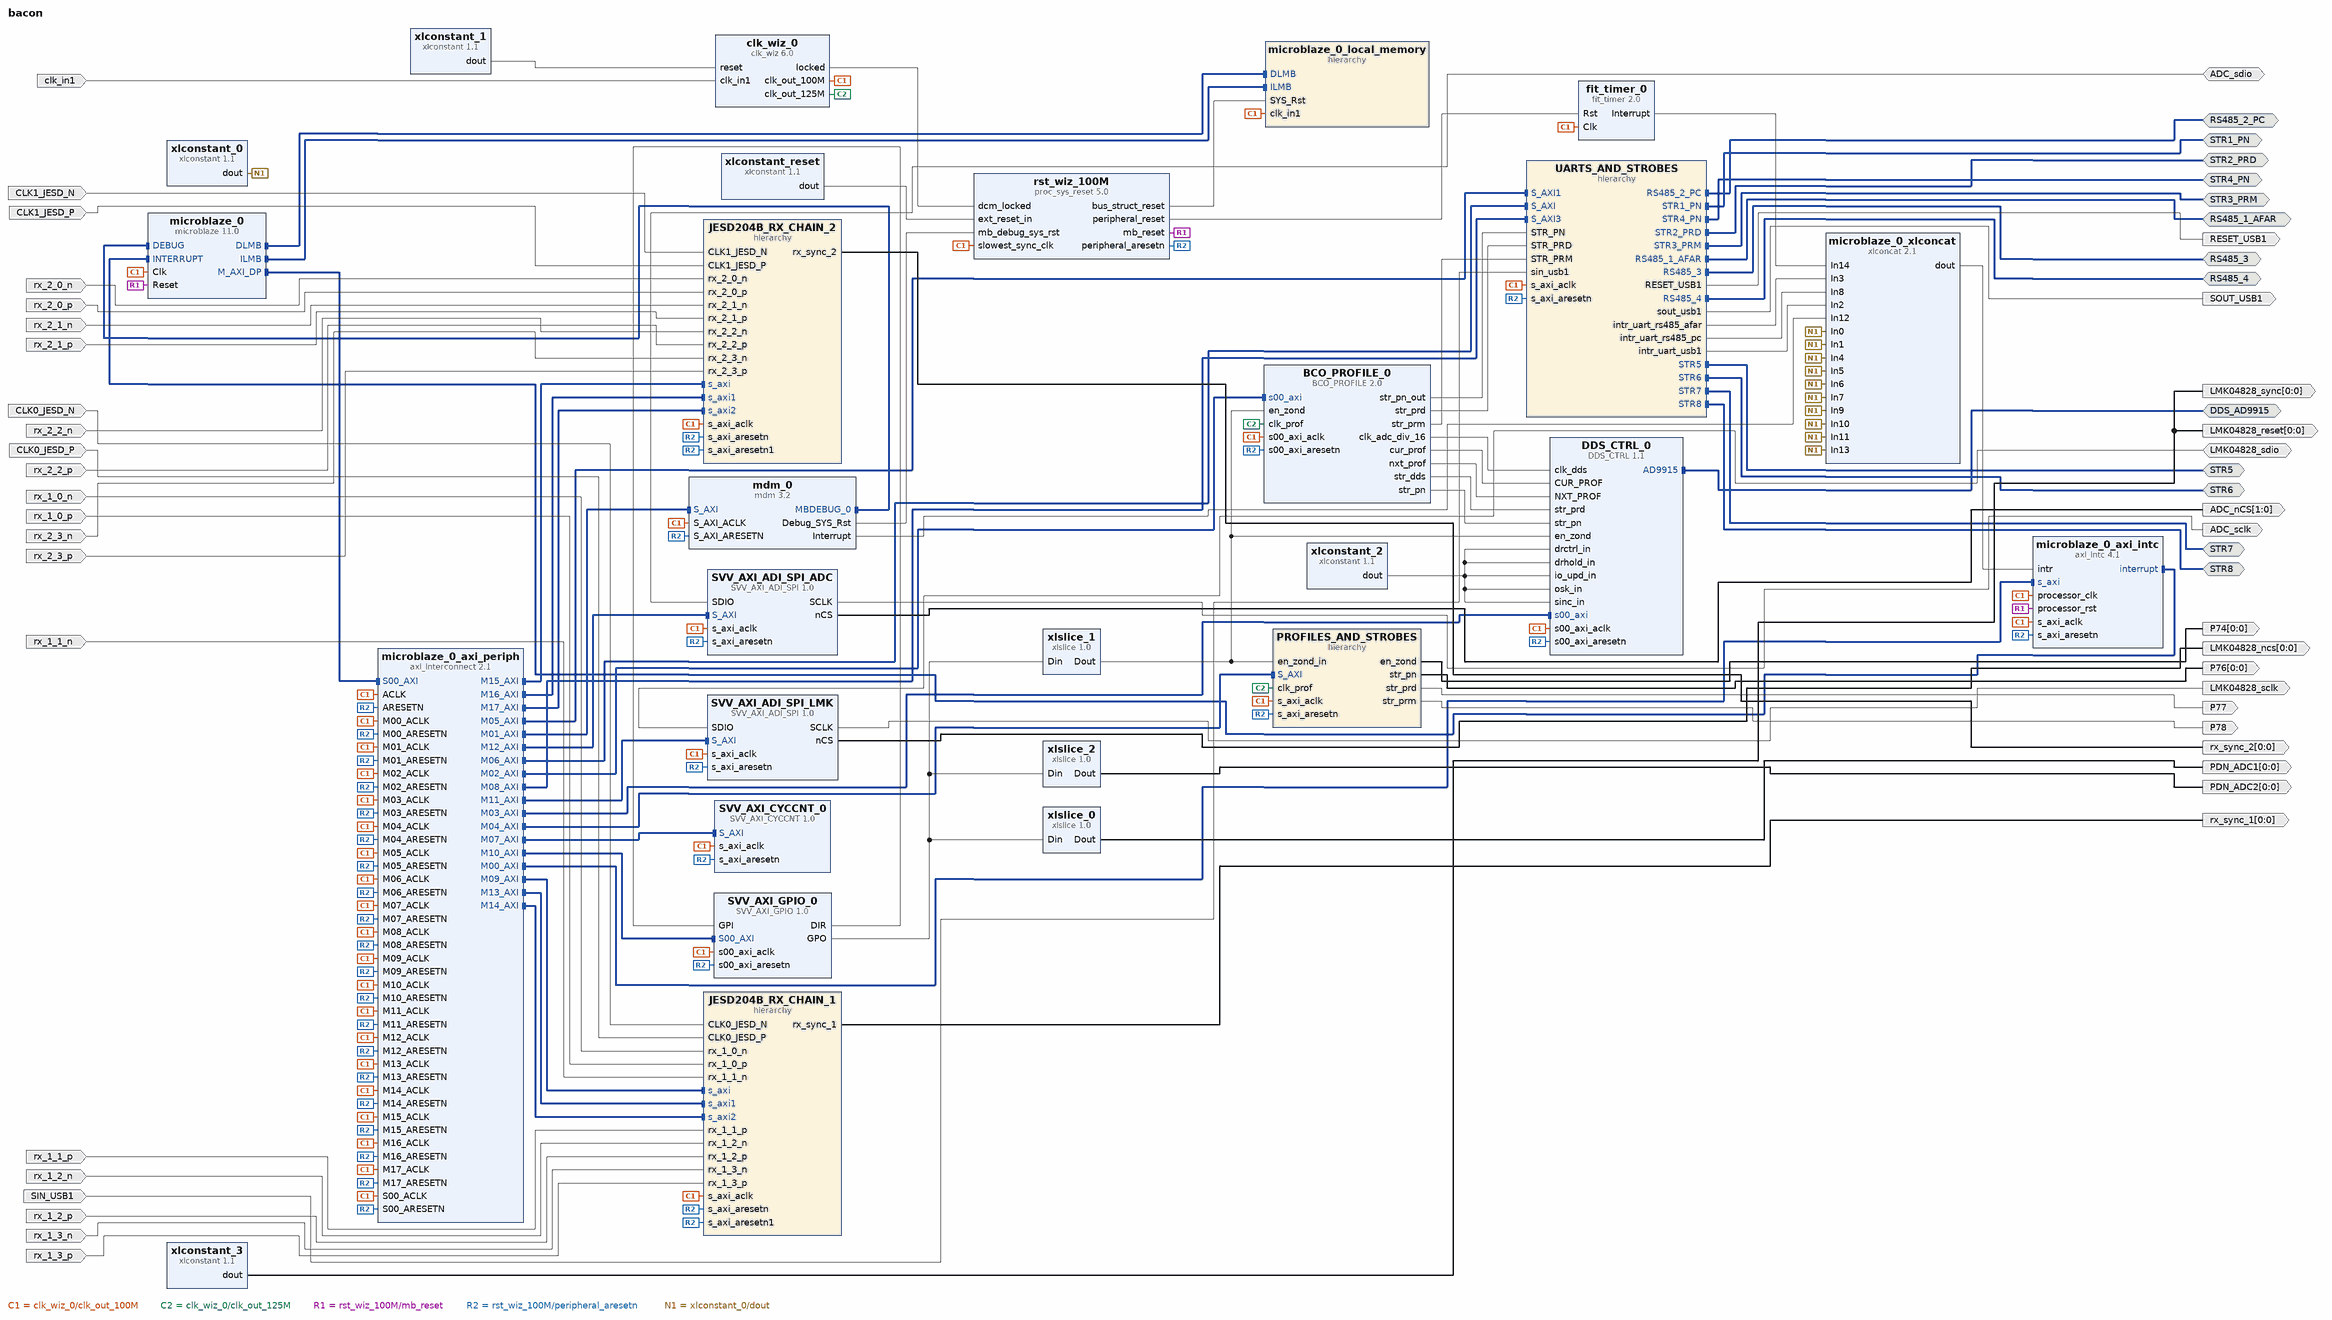
[diagram p0: block diagram of the top level]
# Vivado block design bacon, xc7k410tffg900-2, Vivado 2023.2.2
create_bd_design bacon

create_bd_intf_port -mode Master -vlnv eliars:user:DDS_AD9915_CTRL_rtl:1.0 DDS_AD9915
create_bd_intf_port -mode Master -vlnv eliars:user:SER_TRANS_rtl:1.0 STR4_PN
create_bd_intf_port -mode Master -vlnv eliars:user:SER_TRANS_rtl:1.0 STR1_PN
create_bd_intf_port -mode Master -vlnv eliars:user:SER_TRANS_rtl:1.0 STR2_PRD
create_bd_intf_port -mode Master -vlnv eliars:user:SER_TRANS_rtl:1.0 STR3_PRM
create_bd_intf_port -mode Master -vlnv eliars:user:SER_TRANS_rtl:1.0 RS485_2_PC
create_bd_intf_port -mode Master -vlnv eliars:user:SER_TRANS_rtl:1.0 RS485_1_AFAR
create_bd_intf_port -mode Master -vlnv eliars:user:SER_TRANS_rtl:1.0 RS485_3
create_bd_intf_port -mode Master -vlnv eliars:user:SER_TRANS_rtl:1.0 RS485_4
create_bd_intf_port -mode Master -vlnv eliars:user:SER_TRANS_rtl:1.0 STR5
create_bd_intf_port -mode Master -vlnv eliars:user:SER_TRANS_rtl:1.0 STR6
create_bd_intf_port -mode Master -vlnv eliars:user:SER_TRANS_rtl:1.0 STR7
create_bd_intf_port -mode Master -vlnv eliars:user:SER_TRANS_rtl:1.0 STR8
create_bd_port -dir I -type clk clk_in1
set_property -dict {CONFIG.FREQ_HZ 100000000} [get_bd_ports clk_in1]
create_bd_port -dir O SOUT_USB1
create_bd_port -dir I SIN_USB1
create_bd_port -dir I CLK0_JESD_P
create_bd_port -dir I CLK0_JESD_N
create_bd_port -dir I CLK1_JESD_P
create_bd_port -dir I CLK1_JESD_N
create_bd_port -dir O RESET_USB1
create_bd_port -dir O -from 0 -to 0 P76
create_bd_port -dir O P77
create_bd_port -dir O -from 0 -to 0 P74
create_bd_port -dir O P78
create_bd_port -dir I rx_1_0_p
create_bd_port -dir I rx_1_0_n
create_bd_port -dir I rx_1_1_p
create_bd_port -dir I rx_1_1_n
create_bd_port -dir I rx_1_2_p
create_bd_port -dir I rx_1_2_n
create_bd_port -dir I rx_1_3_p
create_bd_port -dir I rx_1_3_n
create_bd_port -dir O -from 0 -to 0 rx_sync_1
create_bd_port -dir IO LMK04828_sdio
create_bd_port -dir O LMK04828_sclk
create_bd_port -dir O -from 0 -to 0 LMK04828_ncs
create_bd_port -dir O -from 0 -to 0 LMK04828_reset
create_bd_port -dir O -from 0 -to 0 LMK04828_sync
create_bd_port -dir O -from 0 -to 0 PDN_ADC1
create_bd_port -dir O -from 0 -to 0 PDN_ADC2
create_bd_port -dir O -from 1 -to 0 ADC_nCS
create_bd_port -dir IO ADC_sdio
create_bd_port -dir O ADC_sclk
create_bd_port -dir I rx_2_0_p
create_bd_port -dir I rx_2_0_n
create_bd_port -dir I rx_2_1_p
create_bd_port -dir I rx_2_1_n
create_bd_port -dir I rx_2_2_p
create_bd_port -dir I rx_2_2_n
create_bd_port -dir I rx_2_3_p
create_bd_port -dir I rx_2_3_n
create_bd_port -dir O -from 0 -to 0 rx_sync_2

create_bd_cell -type ip -vlnv xilinx.com:ip:microblaze:11.0 microblaze_0
set_property -dict [list \
  CONFIG.C_DEBUG_ENABLED 1 \
  CONFIG.C_D_AXI 1 \
  CONFIG.C_D_LMB 1 \
  CONFIG.C_I_LMB 1 \
  CONFIG.C_USE_BARREL 1 \
  CONFIG.C_USE_DIV 1 \
  CONFIG.C_USE_HW_MUL 2 \
  CONFIG.C_USE_INTERRUPT 2 \
  CONFIG.C_USE_MSR_INSTR 1 \
  CONFIG.C_USE_PCMP_INSTR 1 \
] [get_bd_cells microblaze_0]
create_bd_cell -type hier microblaze_0_local_memory
create_bd_cell -type ip -vlnv xilinx.com:ip:axi_interconnect:2.1 microblaze_0_axi_periph
set_property -dict {CONFIG.NUM_MI 18 CONFIG.NUM_SI 1} [get_bd_cells microblaze_0_axi_periph]
create_bd_cell -type ip -vlnv xilinx.com:ip:axi_intc:4.1 microblaze_0_axi_intc
set_property -dict {CONFIG.C_HAS_FAST 1 CONFIG.C_IRQ_IS_LEVEL 0} [get_bd_cells microblaze_0_axi_intc]
create_bd_cell -type ip -vlnv xilinx.com:ip:xlconcat:2.1 microblaze_0_xlconcat
set_property -dict [list \
  CONFIG.IN0_WIDTH 1 \
  CONFIG.IN10_WIDTH 1 \
  CONFIG.IN11_WIDTH 1 \
  CONFIG.IN12_WIDTH 1 \
  CONFIG.IN13_WIDTH 1 \
  CONFIG.IN14_WIDTH 1 \
  CONFIG.IN1_WIDTH 1 \
  CONFIG.IN2_WIDTH 1 \
  CONFIG.IN3_WIDTH 1 \
  CONFIG.IN4_WIDTH 1 \
  CONFIG.IN5_WIDTH 1 \
  CONFIG.IN6_WIDTH 1 \
  CONFIG.IN7_WIDTH 1 \
  CONFIG.IN8_WIDTH 1 \
  CONFIG.IN9_WIDTH 1 \
  CONFIG.NUM_PORTS 15 \
] [get_bd_cells microblaze_0_xlconcat]
create_bd_cell -type ip -vlnv xilinx.com:ip:mdm:3.2 mdm_0
set_property -dict {CONFIG.C_ADDR_SIZE 32 CONFIG.C_M_AXI_ADDR_WIDTH 32 CONFIG.C_USE_UART 1} [get_bd_cells mdm_0]
create_bd_cell -type ip -vlnv xilinx.com:ip:proc_sys_reset:5.0 rst_wiz_100M
create_bd_cell -type ip -vlnv xilinx.com:ip:clk_wiz:6.0 clk_wiz_0
set_property -dict [list \
  CONFIG.CLKIN2_JITTER_PS 166.66 \
  CONFIG.CLKOUT2_JITTER 125.247 \
  CONFIG.CLKOUT2_PHASE_ERROR 98.575 \
  CONFIG.CLKOUT2_REQUESTED_OUT_FREQ 125.000 \
  CONFIG.CLKOUT2_USED true \
  CONFIG.CLKOUT3_JITTER 114.829 \
  CONFIG.CLKOUT3_PHASE_ERROR 98.575 \
  CONFIG.CLKOUT3_REQUESTED_OUT_FREQ 200.000 \
  CONFIG.CLKOUT3_USED true \
  CONFIG.CLKOUT4_JITTER 159.371 \
  CONFIG.CLKOUT4_PHASE_ERROR 98.575 \
  CONFIG.CLKOUT4_REQUESTED_OUT_FREQ 40.000 \
  CONFIG.CLKOUT4_USED true \
  CONFIG.CLK_OUT1_PORT clk_out_100M \
  CONFIG.CLK_OUT2_PORT clk_out_125M \
  CONFIG.CLK_OUT3_PORT clk_out_200M \
  CONFIG.CLK_OUT4_PORT clk_out_40M \
  CONFIG.MMCM_CLKIN2_PERIOD 10.000 \
  CONFIG.MMCM_CLKOUT1_DIVIDE 8 \
  CONFIG.MMCM_CLKOUT2_DIVIDE 5 \
  CONFIG.MMCM_CLKOUT3_DIVIDE 25 \
  CONFIG.NUM_OUT_CLKS 4 \
  CONFIG.SECONDARY_IN_FREQ 100.000 \
  CONFIG.SECONDARY_SOURCE Single_ended_clock_capable_pin \
  CONFIG.USE_INCLK_SWITCHOVER false \
] [get_bd_cells clk_wiz_0]
create_bd_cell -type ip -vlnv xilinx.com:ip:xlconstant:1.1 xlconstant_reset
create_bd_cell -type ip -vlnv xilinx.com:ip:xlconstant:1.1 xlconstant_0
set_property -dict {CONFIG.CONST_VAL 0 CONFIG.CONST_WIDTH 1} [get_bd_cells xlconstant_0]
create_bd_cell -type ip -vlnv eliars.ru:user:BCO_PROFILE:2.0 BCO_PROFILE_0
create_bd_cell -type ip -vlnv eliars.ru:user:DDS_CTRL:1.1 DDS_CTRL_0
create_bd_cell -type ip -vlnv xilinx.com:ip:xlconstant:1.1 xlconstant_2
set_property -dict {CONFIG.CONST_VAL 0} [get_bd_cells xlconstant_2]
create_bd_cell -type hier UARTS_AND_STROBES
create_bd_cell -type ip -vlnv xilinx.com:user:SVV_AXI_CYCCNT:1.0 SVV_AXI_CYCCNT_0
create_bd_cell -type hier PROFILES_AND_STROBES
create_bd_cell -type ip -vlnv xilinx.com:ip:xlconstant:1.1 xlconstant_1
set_property -dict {CONFIG.CONST_VAL 0} [get_bd_cells xlconstant_1]
create_bd_cell -type ip -vlnv xilinx.com:ip:fit_timer:2.0 fit_timer_0
set_property -dict {CONFIG.C_NO_CLOCKS 1000000} [get_bd_cells fit_timer_0]
create_bd_cell -type hier JESD204B_RX_CHAIN_1
create_bd_cell -type ip -vlnv xilinx.com:user:SVV_AXI_GPIO:1.0 SVV_AXI_GPIO_0
set_property -dict {CONFIG.ODR_INIT 0x00030000} [get_bd_cells SVV_AXI_GPIO_0]
create_bd_cell -type ip -vlnv xilinx.com:ip:xlslice:1.0 xlslice_1
create_bd_cell -type ip -vlnv xilinx.com:user:SVV_AXI_ADI_SPI:1.0 SVV_AXI_ADI_SPI_LMK
create_bd_cell -type ip -vlnv xilinx.com:ip:xlconstant:1.1 xlconstant_3
set_property -dict {CONFIG.CONST_VAL 0} [get_bd_cells xlconstant_3]
create_bd_cell -type ip -vlnv xilinx.com:ip:xlslice:1.0 xlslice_0
set_property -dict {CONFIG.DIN_FROM 16 CONFIG.DIN_TO 16} [get_bd_cells xlslice_0]
create_bd_cell -type ip -vlnv xilinx.com:ip:xlslice:1.0 xlslice_2
set_property -dict {CONFIG.DIN_FROM 17 CONFIG.DIN_TO 17} [get_bd_cells xlslice_2]
create_bd_cell -type ip -vlnv xilinx.com:user:SVV_AXI_ADI_SPI:1.0 SVV_AXI_ADI_SPI_ADC
set_property -dict {CONFIG.SLAVES 2} [get_bd_cells SVV_AXI_ADI_SPI_ADC]
create_bd_cell -type hier JESD204B_RX_CHAIN_2

# ---- hierarchy /microblaze_0_local_memory ----
current_bd_instance /microblaze_0_local_memory
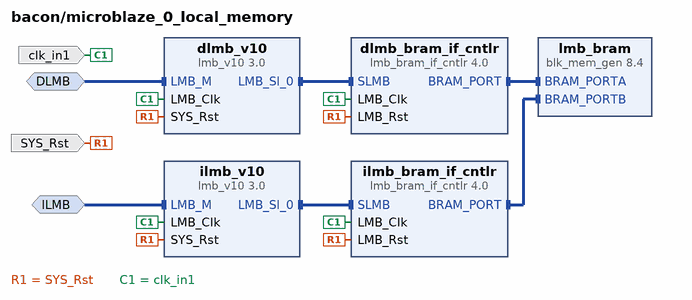
[diagram p1: block diagram inside /microblaze_0_local_memory]
create_bd_intf_pin -mode MirroredMaster -vlnv xilinx.com:interface:lmb_rtl:1.0 DLMB
create_bd_intf_pin -mode MirroredMaster -vlnv xilinx.com:interface:lmb_rtl:1.0 ILMB
create_bd_pin -dir I -type clk clk_in1
create_bd_pin -dir I -type rst SYS_Rst

create_bd_cell -type ip -vlnv xilinx.com:ip:lmb_v10:3.0 dlmb_v10
set_property -dict {CONFIG.C_LMB_NUM_SLAVES 1} [get_bd_cells dlmb_v10]
create_bd_cell -type ip -vlnv xilinx.com:ip:lmb_v10:3.0 ilmb_v10
create_bd_cell -type ip -vlnv xilinx.com:ip:lmb_bram_if_cntlr:4.0 dlmb_bram_if_cntlr
set_property -dict {CONFIG.C_ECC 0} [get_bd_cells dlmb_bram_if_cntlr]
create_bd_cell -type ip -vlnv xilinx.com:ip:lmb_bram_if_cntlr:4.0 ilmb_bram_if_cntlr
set_property -dict {CONFIG.C_ECC 0} [get_bd_cells ilmb_bram_if_cntlr]
create_bd_cell -type ip -vlnv xilinx.com:ip:blk_mem_gen:8.4 lmb_bram
set_property -dict {CONFIG.Memory_Type True_Dual_Port_RAM CONFIG.use_bram_block BRAM_Controller} [get_bd_cells lmb_bram]

# ---- hierarchy /UARTS_AND_STROBES ----
current_bd_instance /UARTS_AND_STROBES
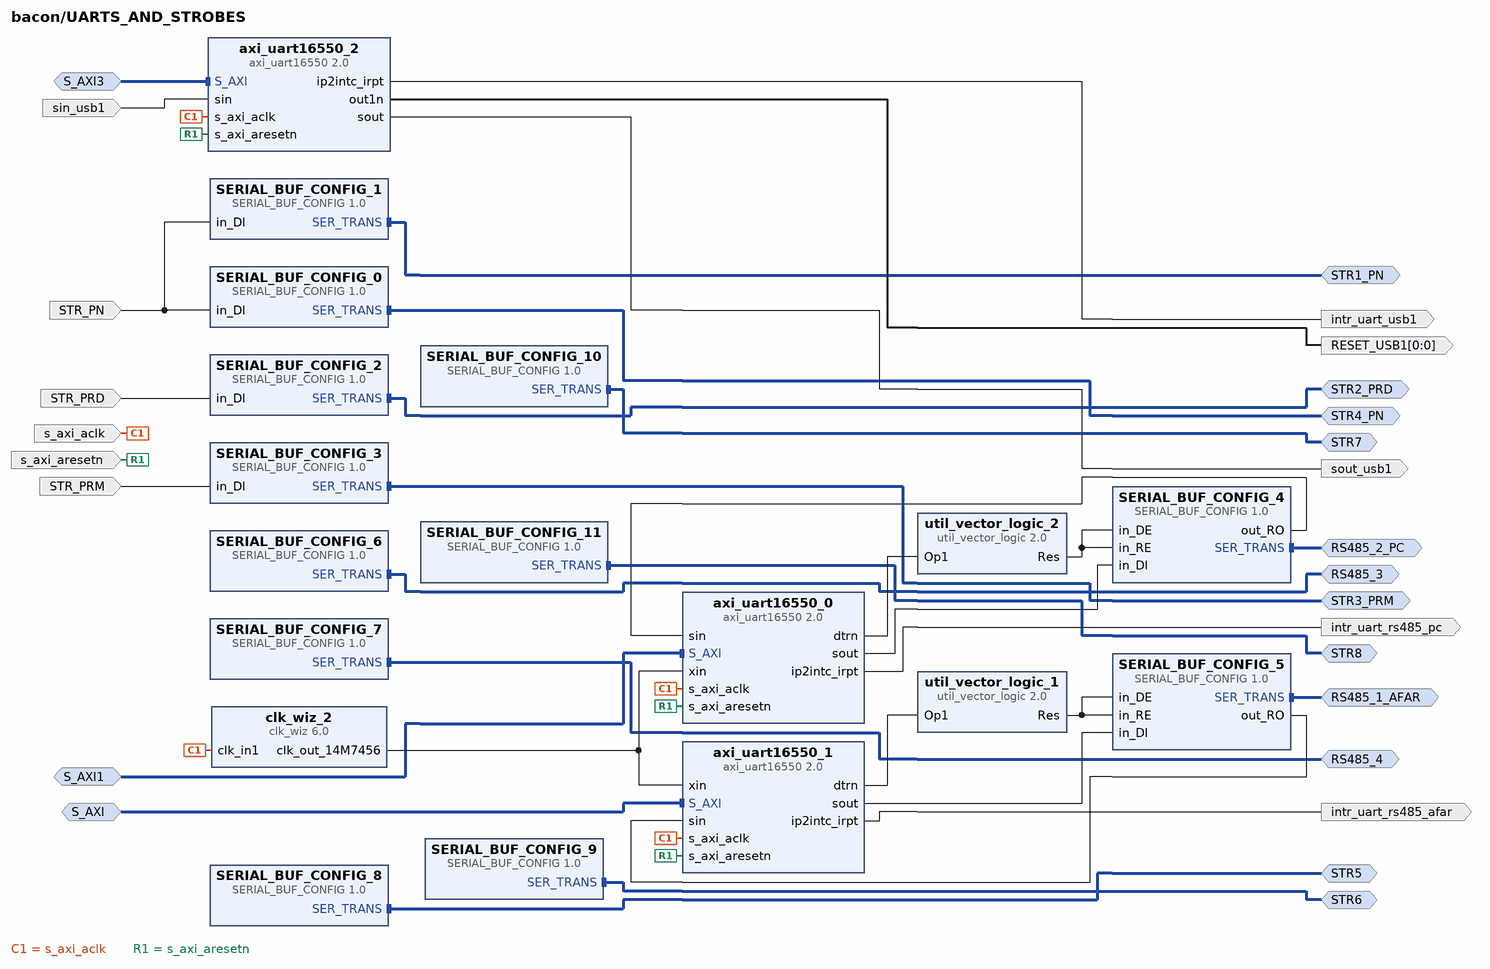
[diagram p2: block diagram inside /UARTS_AND_STROBES]
create_bd_intf_pin -mode Master -vlnv eliars:user:SER_TRANS_rtl:1.0 STR4_PN
create_bd_intf_pin -mode Slave -vlnv xilinx.com:interface:aximm_rtl:1.0 S_AXI
create_bd_intf_pin -mode Master -vlnv eliars:user:SER_TRANS_rtl:1.0 STR1_PN
create_bd_intf_pin -mode Master -vlnv eliars:user:SER_TRANS_rtl:1.0 STR2_PRD
create_bd_intf_pin -mode Master -vlnv eliars:user:SER_TRANS_rtl:1.0 STR3_PRM
create_bd_intf_pin -mode Master -vlnv eliars:user:SER_TRANS_rtl:1.0 RS485_2_PC
create_bd_intf_pin -mode Slave -vlnv xilinx.com:interface:aximm_rtl:1.0 S_AXI1
create_bd_intf_pin -mode Master -vlnv eliars:user:SER_TRANS_rtl:1.0 RS485_1_AFAR
create_bd_intf_pin -mode Master -vlnv eliars:user:SER_TRANS_rtl:1.0 RS485_3
create_bd_intf_pin -mode Slave -vlnv xilinx.com:interface:aximm_rtl:1.0 S_AXI3
create_bd_intf_pin -mode Master -vlnv eliars:user:SER_TRANS_rtl:1.0 RS485_4
create_bd_intf_pin -mode Master -vlnv eliars:user:SER_TRANS_rtl:1.0 STR5
create_bd_intf_pin -mode Master -vlnv eliars:user:SER_TRANS_rtl:1.0 STR6
create_bd_intf_pin -mode Master -vlnv eliars:user:SER_TRANS_rtl:1.0 STR7
create_bd_intf_pin -mode Master -vlnv eliars:user:SER_TRANS_rtl:1.0 STR8
create_bd_pin -dir I STR_PN
create_bd_pin -dir I -type clk s_axi_aclk
create_bd_pin -dir I -type rst s_axi_aresetn
create_bd_pin -dir I STR_PRD
create_bd_pin -dir I STR_PRM
create_bd_pin -dir O intr_uart_rs485_pc
create_bd_pin -dir O intr_uart_rs485_afar
create_bd_pin -dir O sout_usb1
create_bd_pin -dir I sin_usb1
create_bd_pin -dir O intr_uart_usb1
create_bd_pin -dir O -from 0 -to 0 RESET_USB1

create_bd_cell -type ip -vlnv eliars:user:SERIAL_BUF_CONFIG:1.0 SERIAL_BUF_CONFIG_0
set_property -dict {CONFIG.MODE {Transmit Only}} [get_bd_cells SERIAL_BUF_CONFIG_0]
create_bd_cell -type ip -vlnv xilinx.com:ip:axi_uart16550:2.0 axi_uart16550_1
set_property -dict [list \
  CONFIG.C_EXTERNAL_XIN_CLK_HZ 14745600 \
  CONFIG.C_EXTERNAL_XIN_CLK_HZ_d 14.7456 \
  CONFIG.C_HAS_EXTERNAL_XIN 1 \
] [get_bd_cells axi_uart16550_1]
create_bd_cell -type ip -vlnv eliars:user:SERIAL_BUF_CONFIG:1.0 SERIAL_BUF_CONFIG_1
set_property -dict {CONFIG.MODE {Transmit Only}} [get_bd_cells SERIAL_BUF_CONFIG_1]
create_bd_cell -type ip -vlnv eliars:user:SERIAL_BUF_CONFIG:1.0 SERIAL_BUF_CONFIG_2
set_property -dict {CONFIG.MODE {Transmit Only}} [get_bd_cells SERIAL_BUF_CONFIG_2]
create_bd_cell -type ip -vlnv eliars:user:SERIAL_BUF_CONFIG:1.0 SERIAL_BUF_CONFIG_3
set_property -dict {CONFIG.MODE {Transmit Only}} [get_bd_cells SERIAL_BUF_CONFIG_3]
create_bd_cell -type ip -vlnv eliars:user:SERIAL_BUF_CONFIG:1.0 SERIAL_BUF_CONFIG_4
create_bd_cell -type ip -vlnv xilinx.com:ip:axi_uart16550:2.0 axi_uart16550_0
set_property -dict [list \
  CONFIG.C_EXTERNAL_XIN_CLK_HZ 14745600 \
  CONFIG.C_EXTERNAL_XIN_CLK_HZ_d 14.7456 \
  CONFIG.C_HAS_EXTERNAL_XIN 1 \
] [get_bd_cells axi_uart16550_0]
create_bd_cell -type ip -vlnv eliars:user:SERIAL_BUF_CONFIG:1.0 SERIAL_BUF_CONFIG_5
set_property -dict {CONFIG.MODE {Half Duplex}} [get_bd_cells SERIAL_BUF_CONFIG_5]
create_bd_cell -type ip -vlnv xilinx.com:ip:clk_wiz:6.0 clk_wiz_2
set_property -dict [list \
  CONFIG.CLKOUT1_JITTER 462.254 \
  CONFIG.CLKOUT1_PHASE_ERROR 507.185 \
  CONFIG.CLKOUT1_REQUESTED_OUT_FREQ 14.7456 \
  CONFIG.CLK_OUT1_PORT clk_out_14M7456 \
  CONFIG.MMCM_CLKFBOUT_MULT_F 60.250 \
  CONFIG.MMCM_CLKOUT0_DIVIDE_F 58.375 \
  CONFIG.MMCM_DIVCLK_DIVIDE 7 \
  CONFIG.USE_LOCKED false \
  CONFIG.USE_RESET false \
] [get_bd_cells clk_wiz_2]
create_bd_cell -type ip -vlnv eliars:user:SERIAL_BUF_CONFIG:1.0 SERIAL_BUF_CONFIG_6
set_property -dict {CONFIG.MODE Unused} [get_bd_cells SERIAL_BUF_CONFIG_6]
create_bd_cell -type ip -vlnv xilinx.com:ip:util_vector_logic:2.0 util_vector_logic_1
set_property -dict {CONFIG.C_OPERATION not CONFIG.C_SIZE 1} [get_bd_cells util_vector_logic_1]
create_bd_cell -type ip -vlnv xilinx.com:ip:util_vector_logic:2.0 util_vector_logic_2
set_property -dict {CONFIG.C_OPERATION not} [get_bd_cells util_vector_logic_2]
create_bd_cell -type ip -vlnv eliars:user:SERIAL_BUF_CONFIG:1.0 SERIAL_BUF_CONFIG_7
set_property -dict {CONFIG.MODE Unused} [get_bd_cells SERIAL_BUF_CONFIG_7]
create_bd_cell -type ip -vlnv eliars:user:SERIAL_BUF_CONFIG:1.0 SERIAL_BUF_CONFIG_8
set_property -dict {CONFIG.MODE Unused} [get_bd_cells SERIAL_BUF_CONFIG_8]
create_bd_cell -type ip -vlnv eliars:user:SERIAL_BUF_CONFIG:1.0 SERIAL_BUF_CONFIG_9
set_property -dict {CONFIG.MODE Unused} [get_bd_cells SERIAL_BUF_CONFIG_9]
create_bd_cell -type ip -vlnv eliars:user:SERIAL_BUF_CONFIG:1.0 SERIAL_BUF_CONFIG_10
set_property -dict {CONFIG.MODE Unused} [get_bd_cells SERIAL_BUF_CONFIG_10]
create_bd_cell -type ip -vlnv eliars:user:SERIAL_BUF_CONFIG:1.0 SERIAL_BUF_CONFIG_11
set_property -dict {CONFIG.MODE Unused} [get_bd_cells SERIAL_BUF_CONFIG_11]
create_bd_cell -type ip -vlnv xilinx.com:ip:axi_uart16550:2.0 axi_uart16550_2
set_property -dict [list \
  CONFIG.C_EXTERNAL_XIN_CLK_HZ 14745600 \
  CONFIG.C_EXTERNAL_XIN_CLK_HZ_d 14.7456 \
  CONFIG.C_HAS_EXTERNAL_XIN 1 \
] [get_bd_cells axi_uart16550_2]

# ---- hierarchy /PROFILES_AND_STROBES ----
current_bd_instance /PROFILES_AND_STROBES
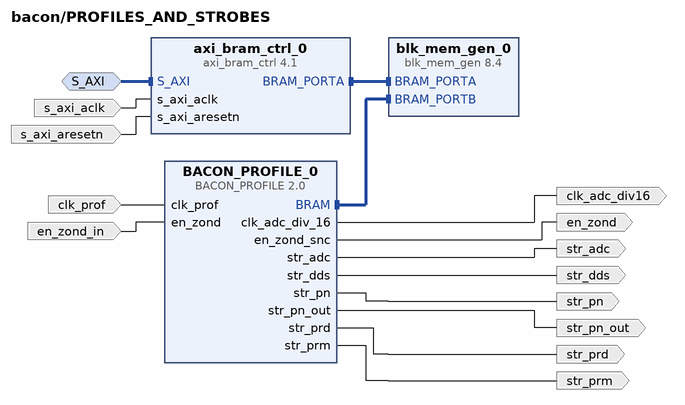
[diagram p3: block diagram inside /PROFILES_AND_STROBES]
create_bd_intf_pin -mode Slave -vlnv xilinx.com:interface:aximm_rtl:1.0 S_AXI
create_bd_pin -dir I -type clk s_axi_aclk
create_bd_pin -dir I -type rst s_axi_aresetn
create_bd_pin -dir I en_zond_in
create_bd_pin -dir I clk_prof
create_bd_pin -dir O str_pn
create_bd_pin -dir O str_pn_out
create_bd_pin -dir O str_dds
create_bd_pin -dir O str_prd
create_bd_pin -dir O str_prm
create_bd_pin -dir O str_adc
create_bd_pin -dir O clk_adc_div16
create_bd_pin -dir O en_zond

create_bd_cell -type ip -vlnv xilinx.com:ip:axi_bram_ctrl:4.1 axi_bram_ctrl_0
set_property -dict {CONFIG.DATA_WIDTH 512 CONFIG.SINGLE_PORT_BRAM 1} [get_bd_cells axi_bram_ctrl_0]
create_bd_cell -type ip -vlnv xilinx.com:user:BACON_PROFILE:2.0 BACON_PROFILE_0
create_bd_cell -type ip -vlnv xilinx.com:ip:blk_mem_gen:8.4 blk_mem_gen_0
set_property -dict {CONFIG.Memory_Type True_Dual_Port_RAM} [get_bd_cells blk_mem_gen_0]

# ---- hierarchy /JESD204B_RX_CHAIN_1 ----
current_bd_instance /JESD204B_RX_CHAIN_1
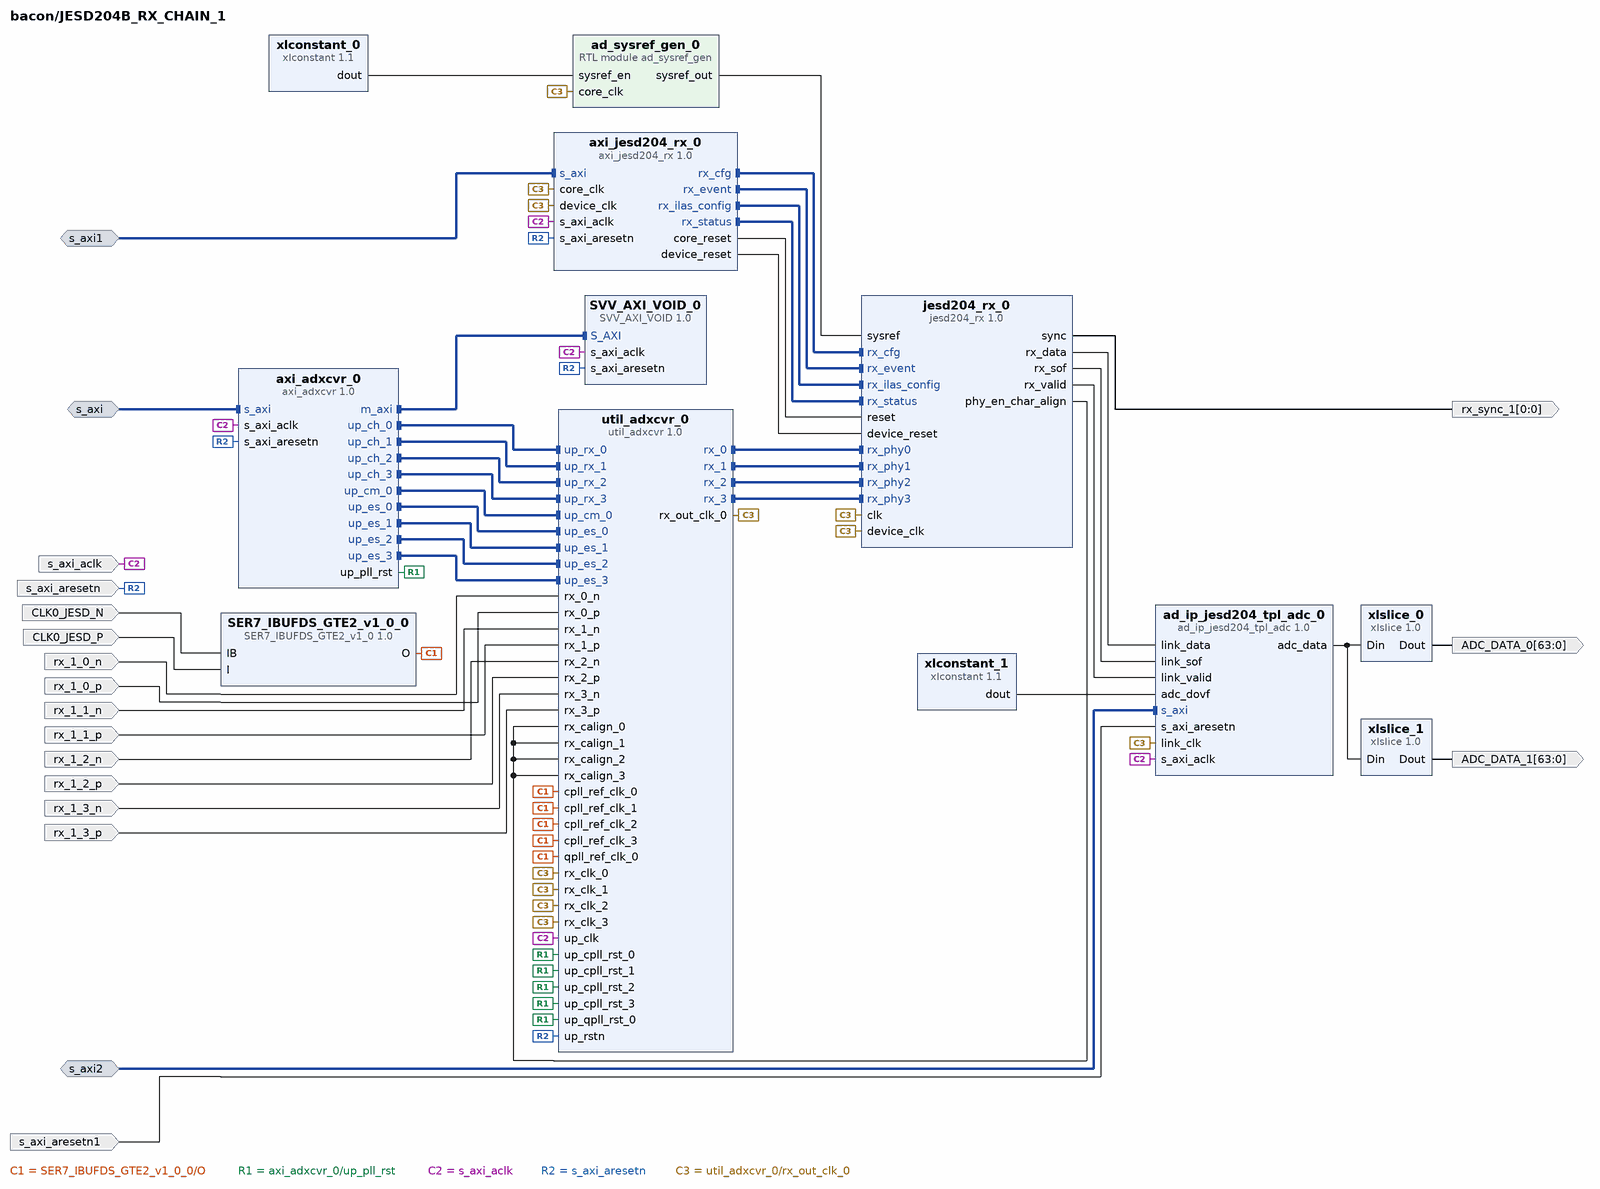
[diagram p4: block diagram inside /JESD204B_RX_CHAIN_1]
create_bd_intf_pin -mode Slave -vlnv xilinx.com:interface:aximm_rtl:1.0 s_axi
create_bd_intf_pin -mode Slave -vlnv xilinx.com:interface:aximm_rtl:1.0 s_axi1
create_bd_intf_pin -mode Slave -vlnv xilinx.com:interface:aximm_rtl:1.0 s_axi2
create_bd_pin -dir I -type clk s_axi_aclk
create_bd_pin -dir I -type rst s_axi_aresetn
create_bd_pin -dir I CLK0_JESD_P
create_bd_pin -dir I CLK0_JESD_N
create_bd_pin -dir I rx_1_0_p
create_bd_pin -dir I rx_1_0_n
create_bd_pin -dir I rx_1_1_p
create_bd_pin -dir I rx_1_1_n
create_bd_pin -dir I rx_1_2_p
create_bd_pin -dir I rx_1_2_n
create_bd_pin -dir I rx_1_3_p
create_bd_pin -dir I rx_1_3_n
create_bd_pin -dir O -from 0 -to 0 rx_sync_1
create_bd_pin -dir I -type rst s_axi_aresetn1
create_bd_pin -dir O -from 63 -to 0 ADC_DATA_0
create_bd_pin -dir O -from 63 -to 0 ADC_DATA_1

create_bd_cell -type ip -vlnv analog.com:user:axi_jesd204_rx:1.0 axi_jesd204_rx_0
set_property -dict {CONFIG.NUM_LANES 4} [get_bd_cells axi_jesd204_rx_0]
create_bd_cell -type ip -vlnv analog.com:user:axi_adxcvr:1.0 axi_adxcvr_0
set_property -dict [list \
  CONFIG.DEV_PACKAGE 3 \
  CONFIG.FPGA_FAMILY 2 \
  CONFIG.FPGA_TECHNOLOGY 1 \
  CONFIG.FPGA_VOLTAGE 970 \
  CONFIG.NUM_OF_LANES 4 \
  CONFIG.SPEED_GRADE 20 \
  CONFIG.XCVR_TYPE 2 \
] [get_bd_cells axi_adxcvr_0]
create_bd_cell -type ip -vlnv xilinx.com:user:SER7_IBUFDS_GTE2_v1_0:1.0 SER7_IBUFDS_GTE2_v1_0_0
create_bd_cell -type ip -vlnv analog.com:user:util_adxcvr:1.0 util_adxcvr_0
set_property -dict {CONFIG.RX_NUM_OF_LANES 4 CONFIG.TX_NUM_OF_LANES 0} [get_bd_cells util_adxcvr_0]
create_bd_cell -type ip -vlnv analog.com:user:jesd204_rx:1.0 jesd204_rx_0
set_property -dict {CONFIG.NUM_LANES 4} [get_bd_cells jesd204_rx_0]
create_bd_cell -type module -reference ad_sysref_gen ad_sysref_gen_0
set_property -dict {CONFIG.SYSREF_PERIOD 16} [get_bd_cells ad_sysref_gen_0]
create_bd_cell -type ip -vlnv xilinx.com:ip:xlconstant:1.1 xlconstant_0
create_bd_cell -type ip -vlnv xilinx.com:user:SVV_AXI_VOID:1.0 SVV_AXI_VOID_0
create_bd_cell -type ip -vlnv analog.com:user:ad_ip_jesd204_tpl_adc:1.0 ad_ip_jesd204_tpl_adc_0
set_property -dict {CONFIG.NUM_CHANNELS 2 CONFIG.NUM_LANES 4} [get_bd_cells ad_ip_jesd204_tpl_adc_0]
create_bd_cell -type ip -vlnv xilinx.com:ip:xlconstant:1.1 xlconstant_1
set_property -dict {CONFIG.CONST_VAL 0} [get_bd_cells xlconstant_1]
create_bd_cell -type ip -vlnv xilinx.com:ip:xlslice:1.0 xlslice_0
set_property -dict {CONFIG.DIN_FROM 63 CONFIG.DIN_WIDTH 128} [get_bd_cells xlslice_0]
create_bd_cell -type ip -vlnv xilinx.com:ip:xlslice:1.0 xlslice_1
set_property -dict {CONFIG.DIN_FROM 127 CONFIG.DIN_TO 64 CONFIG.DIN_WIDTH 128} [get_bd_cells xlslice_1]

# ---- hierarchy /JESD204B_RX_CHAIN_2 ----
current_bd_instance /JESD204B_RX_CHAIN_2
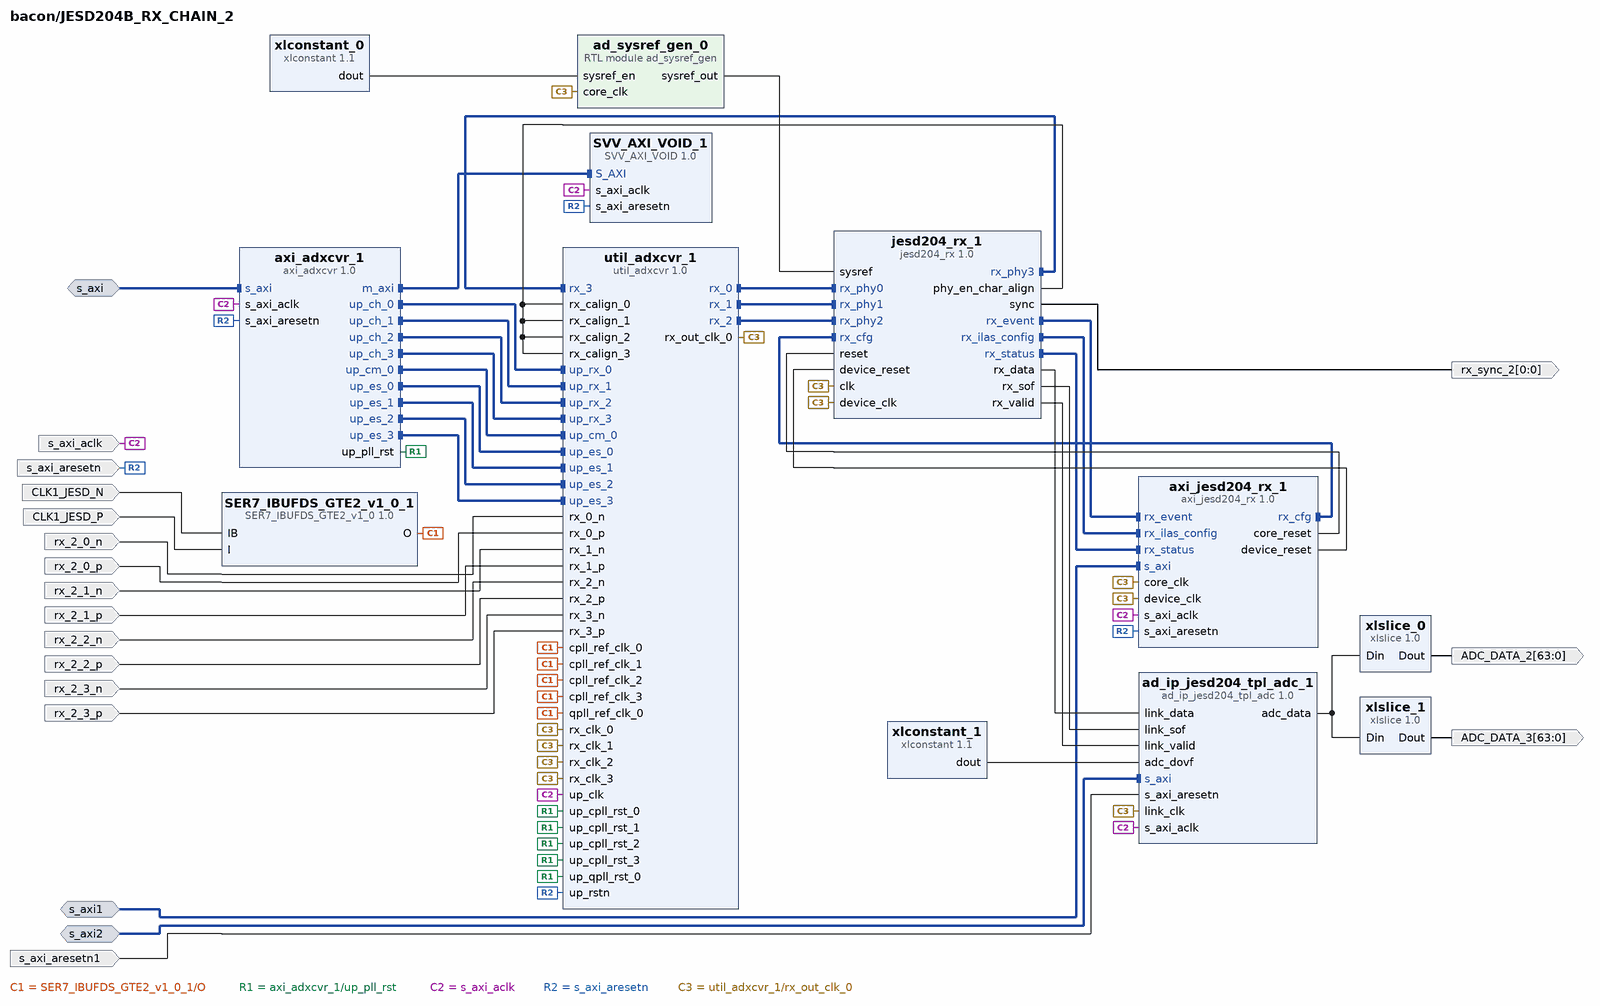
[diagram p5: block diagram inside /JESD204B_RX_CHAIN_2]
create_bd_intf_pin -mode Slave -vlnv xilinx.com:interface:aximm_rtl:1.0 s_axi
create_bd_intf_pin -mode Slave -vlnv xilinx.com:interface:aximm_rtl:1.0 s_axi1
create_bd_intf_pin -mode Slave -vlnv xilinx.com:interface:aximm_rtl:1.0 s_axi2
create_bd_pin -dir I CLK1_JESD_P
create_bd_pin -dir I CLK1_JESD_N
create_bd_pin -dir I -type clk s_axi_aclk
create_bd_pin -dir I -type rst s_axi_aresetn
create_bd_pin -dir I rx_2_1_n
create_bd_pin -dir I rx_2_2_p
create_bd_pin -dir I rx_2_2_n
create_bd_pin -dir I rx_2_3_p
create_bd_pin -dir I rx_2_3_n
create_bd_pin -dir I rx_2_1_p
create_bd_pin -dir I rx_2_0_p
create_bd_pin -dir I rx_2_0_n
create_bd_pin -dir I -type rst s_axi_aresetn1
create_bd_pin -dir O -from 0 -to 0 rx_sync_2
create_bd_pin -dir O -from 63 -to 0 ADC_DATA_2
create_bd_pin -dir O -from 63 -to 0 ADC_DATA_3

create_bd_cell -type ip -vlnv xilinx.com:user:SER7_IBUFDS_GTE2_v1_0:1.0 SER7_IBUFDS_GTE2_v1_0_1
create_bd_cell -type ip -vlnv analog.com:user:axi_adxcvr:1.0 axi_adxcvr_1
set_property -dict {CONFIG.NUM_OF_LANES 4} [get_bd_cells axi_adxcvr_1]
create_bd_cell -type ip -vlnv xilinx.com:user:SVV_AXI_VOID:1.0 SVV_AXI_VOID_1
create_bd_cell -type ip -vlnv analog.com:user:util_adxcvr:1.0 util_adxcvr_1
set_property -dict {CONFIG.RX_NUM_OF_LANES 4 CONFIG.TX_NUM_OF_LANES 0} [get_bd_cells util_adxcvr_1]
create_bd_cell -type ip -vlnv analog.com:user:axi_jesd204_rx:1.0 axi_jesd204_rx_1
create_bd_cell -type ip -vlnv analog.com:user:jesd204_rx:1.0 jesd204_rx_1
set_property -dict {CONFIG.NUM_LANES 4} [get_bd_cells jesd204_rx_1]
create_bd_cell -type module -reference ad_sysref_gen ad_sysref_gen_0
set_property -dict {CONFIG.SYSREF_PERIOD 16} [get_bd_cells ad_sysref_gen_0]
create_bd_cell -type ip -vlnv xilinx.com:ip:xlconstant:1.1 xlconstant_0
create_bd_cell -type ip -vlnv analog.com:user:ad_ip_jesd204_tpl_adc:1.0 ad_ip_jesd204_tpl_adc_1
set_property -dict {CONFIG.NUM_CHANNELS 2 CONFIG.NUM_LANES 4} [get_bd_cells ad_ip_jesd204_tpl_adc_1]
create_bd_cell -type ip -vlnv xilinx.com:ip:xlslice:1.0 xlslice_0
set_property -dict {CONFIG.DIN_FROM 63 CONFIG.DIN_WIDTH 128} [get_bd_cells xlslice_0]
create_bd_cell -type ip -vlnv xilinx.com:ip:xlslice:1.0 xlslice_1
set_property -dict {CONFIG.DIN_FROM 127 CONFIG.DIN_TO 64 CONFIG.DIN_WIDTH 128} [get_bd_cells xlslice_1]
create_bd_cell -type ip -vlnv xilinx.com:ip:xlconstant:1.1 xlconstant_1
set_property -dict {CONFIG.CONST_VAL 0} [get_bd_cells xlconstant_1]

# ---- connections ----

current_bd_instance /microblaze_0_local_memory
connect_bd_intf_net -intf_net microblaze_0_dlmb [get_bd_intf_pins dlmb_v10/LMB_M] [get_bd_intf_pins DLMB]
connect_bd_intf_net -intf_net microblaze_0_dlmb_bus [get_bd_intf_pins dlmb_v10/LMB_Sl_0] [get_bd_intf_pins dlmb_bram_if_cntlr/SLMB]
connect_bd_intf_net -intf_net microblaze_0_dlmb_cntlr [get_bd_intf_pins dlmb_bram_if_cntlr/BRAM_PORT] [get_bd_intf_pins lmb_bram/BRAM_PORTA]
connect_bd_intf_net -intf_net microblaze_0_ilmb [get_bd_intf_pins ilmb_v10/LMB_M] [get_bd_intf_pins ILMB]
connect_bd_intf_net -intf_net microblaze_0_ilmb_bus [get_bd_intf_pins ilmb_v10/LMB_Sl_0] [get_bd_intf_pins ilmb_bram_if_cntlr/SLMB]
connect_bd_intf_net -intf_net microblaze_0_ilmb_cntlr [get_bd_intf_pins ilmb_bram_if_cntlr/BRAM_PORT] [get_bd_intf_pins lmb_bram/BRAM_PORTB]
connect_bd_net [get_bd_pins SYS_Rst] \
  [get_bd_pins dlmb_v10/SYS_Rst] [get_bd_pins dlmb_bram_if_cntlr/LMB_Rst] [get_bd_pins ilmb_v10/SYS_Rst] \
  [get_bd_pins ilmb_bram_if_cntlr/LMB_Rst]
connect_bd_net -net microblaze_0_Clk [get_bd_pins clk_in1] \
  [get_bd_pins dlmb_v10/LMB_Clk] [get_bd_pins dlmb_bram_if_cntlr/LMB_Clk] [get_bd_pins ilmb_v10/LMB_Clk] \
  [get_bd_pins ilmb_bram_if_cntlr/LMB_Clk]
set_property HDL_ATTRIBUTE.BMM_INFO_ADDRESS_SPACE {byte  0x00000000 32 > bacon microblaze_0_local_memory/lmb_bram} [get_bd_cells dlmb_bram_if_cntlr]
set_property HDL_ATTRIBUTE.KEEP_HIERARCHY yes [get_bd_cells dlmb_bram_if_cntlr]

current_bd_instance /UARTS_AND_STROBES
connect_bd_intf_net [get_bd_intf_pins STR4_PN] [get_bd_intf_pins SERIAL_BUF_CONFIG_0/SER_TRANS]
connect_bd_intf_net [get_bd_intf_pins STR7] [get_bd_intf_pins SERIAL_BUF_CONFIG_10/SER_TRANS]
connect_bd_intf_net [get_bd_intf_pins STR8] [get_bd_intf_pins SERIAL_BUF_CONFIG_11/SER_TRANS]
connect_bd_intf_net [get_bd_intf_pins STR1_PN] [get_bd_intf_pins SERIAL_BUF_CONFIG_1/SER_TRANS]
connect_bd_intf_net [get_bd_intf_pins STR2_PRD] [get_bd_intf_pins SERIAL_BUF_CONFIG_2/SER_TRANS]
connect_bd_intf_net [get_bd_intf_pins STR3_PRM] [get_bd_intf_pins SERIAL_BUF_CONFIG_3/SER_TRANS]
connect_bd_intf_net [get_bd_intf_pins RS485_2_PC] [get_bd_intf_pins SERIAL_BUF_CONFIG_4/SER_TRANS]
connect_bd_intf_net [get_bd_intf_pins RS485_1_AFAR] [get_bd_intf_pins SERIAL_BUF_CONFIG_5/SER_TRANS]
connect_bd_intf_net [get_bd_intf_pins RS485_3] [get_bd_intf_pins SERIAL_BUF_CONFIG_6/SER_TRANS]
connect_bd_intf_net [get_bd_intf_pins RS485_4] [get_bd_intf_pins SERIAL_BUF_CONFIG_7/SER_TRANS]
connect_bd_intf_net [get_bd_intf_pins STR5] [get_bd_intf_pins SERIAL_BUF_CONFIG_8/SER_TRANS]
connect_bd_intf_net [get_bd_intf_pins STR6] [get_bd_intf_pins SERIAL_BUF_CONFIG_9/SER_TRANS]
connect_bd_intf_net -intf_net S_AXI3_1 [get_bd_intf_pins S_AXI3] [get_bd_intf_pins axi_uart16550_2/S_AXI]
connect_bd_intf_net [get_bd_intf_pins S_AXI1] [get_bd_intf_pins axi_uart16550_0/S_AXI]
connect_bd_intf_net [get_bd_intf_pins S_AXI] [get_bd_intf_pins axi_uart16550_1/S_AXI]
connect_bd_net -net BCO_PROFILE_0_str_pn_out [get_bd_pins STR_PN] [get_bd_pins SERIAL_BUF_CONFIG_0/in_DI] [get_bd_pins SERIAL_BUF_CONFIG_1/in_DI]
connect_bd_net -net BCO_PROFILE_0_str_prd [get_bd_pins STR_PRD] [get_bd_pins SERIAL_BUF_CONFIG_2/in_DI]
connect_bd_net -net BCO_PROFILE_0_str_prm [get_bd_pins STR_PRM] [get_bd_pins SERIAL_BUF_CONFIG_3/in_DI]
connect_bd_net -net INVERTER_1_dout [get_bd_pins util_vector_logic_1/Res] \
  [get_bd_pins SERIAL_BUF_CONFIG_5/in_DE] [get_bd_pins SERIAL_BUF_CONFIG_5/in_RE]
connect_bd_net -net INVERTER_2_dout [get_bd_pins util_vector_logic_2/Res] \
  [get_bd_pins SERIAL_BUF_CONFIG_4/in_DE] [get_bd_pins SERIAL_BUF_CONFIG_4/in_RE]
connect_bd_net [get_bd_pins SERIAL_BUF_CONFIG_4/out_RO] [get_bd_pins axi_uart16550_0/sin]
connect_bd_net [get_bd_pins SERIAL_BUF_CONFIG_5/out_RO] [get_bd_pins axi_uart16550_1/sin]
connect_bd_net [get_bd_pins axi_uart16550_0/dtrn] [get_bd_pins util_vector_logic_2/Op1]
connect_bd_net [get_bd_pins axi_uart16550_0/ip2intc_irpt] [get_bd_pins intr_uart_rs485_pc]
connect_bd_net [get_bd_pins axi_uart16550_0/sout] [get_bd_pins SERIAL_BUF_CONFIG_4/in_DI]
connect_bd_net [get_bd_pins axi_uart16550_1/dtrn] [get_bd_pins util_vector_logic_1/Op1]
connect_bd_net [get_bd_pins axi_uart16550_1/ip2intc_irpt] [get_bd_pins intr_uart_rs485_afar]
connect_bd_net [get_bd_pins axi_uart16550_1/sout] [get_bd_pins SERIAL_BUF_CONFIG_5/in_DI]
connect_bd_net [get_bd_pins axi_uart16550_2/ip2intc_irpt] [get_bd_pins intr_uart_usb1]
connect_bd_net [get_bd_pins axi_uart16550_2/out1n] [get_bd_pins RESET_USB1]
connect_bd_net [get_bd_pins axi_uart16550_2/sout] [get_bd_pins sout_usb1]
connect_bd_net -net clk_wiz_0_clk_out_100M [get_bd_pins s_axi_aclk] \
  [get_bd_pins axi_uart16550_0/s_axi_aclk] [get_bd_pins axi_uart16550_1/s_axi_aclk] [get_bd_pins clk_wiz_2/clk_in1] \
  [get_bd_pins axi_uart16550_2/s_axi_aclk]
connect_bd_net -net clk_wiz_2_clk_out_29M4912 [get_bd_pins clk_wiz_2/clk_out_14M7456] \
  [get_bd_pins axi_uart16550_0/xin] [get_bd_pins axi_uart16550_1/xin]
connect_bd_net -net rst_clk_in1_100M_peripheral_aresetn [get_bd_pins s_axi_aresetn] \
  [get_bd_pins axi_uart16550_0/s_axi_aresetn] [get_bd_pins axi_uart16550_1/s_axi_aresetn] \
  [get_bd_pins axi_uart16550_2/s_axi_aresetn]
connect_bd_net -net sin_usb1_1 [get_bd_pins sin_usb1] [get_bd_pins axi_uart16550_2/sin]

current_bd_instance /PROFILES_AND_STROBES
connect_bd_intf_net [get_bd_intf_pins BACON_PROFILE_0/BRAM] [get_bd_intf_pins blk_mem_gen_0/BRAM_PORTB]
connect_bd_intf_net [get_bd_intf_pins axi_bram_ctrl_0/BRAM_PORTA] [get_bd_intf_pins blk_mem_gen_0/BRAM_PORTA]
connect_bd_intf_net [get_bd_intf_pins S_AXI] [get_bd_intf_pins axi_bram_ctrl_0/S_AXI]
connect_bd_net [get_bd_pins BACON_PROFILE_0/clk_adc_div_16] [get_bd_pins clk_adc_div16]
connect_bd_net [get_bd_pins BACON_PROFILE_0/en_zond_snc] [get_bd_pins en_zond]
connect_bd_net [get_bd_pins BACON_PROFILE_0/str_adc] [get_bd_pins str_adc]
connect_bd_net [get_bd_pins BACON_PROFILE_0/str_dds] [get_bd_pins str_dds]
connect_bd_net [get_bd_pins BACON_PROFILE_0/str_pn] [get_bd_pins str_pn]
connect_bd_net [get_bd_pins BACON_PROFILE_0/str_pn_out] [get_bd_pins str_pn_out]
connect_bd_net [get_bd_pins BACON_PROFILE_0/str_prd] [get_bd_pins str_prd]
connect_bd_net [get_bd_pins BACON_PROFILE_0/str_prm] [get_bd_pins str_prm]
connect_bd_net -net clk_wiz_0_clk_out_100M [get_bd_pins s_axi_aclk] [get_bd_pins axi_bram_ctrl_0/s_axi_aclk]
connect_bd_net -net clk_wiz_0_clk_out_125M [get_bd_pins clk_prof] [get_bd_pins BACON_PROFILE_0/clk_prof]
connect_bd_net -net rst_clk_wiz_0_200M_peripheral_aresetn [get_bd_pins s_axi_aresetn] [get_bd_pins axi_bram_ctrl_0/s_axi_aresetn]
connect_bd_net -net xlslice_0_Dout [get_bd_pins en_zond_in] [get_bd_pins BACON_PROFILE_0/en_zond]
set_property HDL_ATTRIBUTE.BMM_INFO_ADDRESS_SPACE {byte  0xC2000000 512 > bacon PROFILES_AND_STROBES/blk_mem_gen_0} [get_bd_cells axi_bram_ctrl_0]
set_property HDL_ATTRIBUTE.KEEP_HIERARCHY yes [get_bd_cells axi_bram_ctrl_0]

current_bd_instance /JESD204B_RX_CHAIN_1
connect_bd_intf_net [get_bd_intf_pins axi_jesd204_rx_0/s_axi] [get_bd_intf_pins s_axi1]
connect_bd_intf_net [get_bd_intf_pins ad_ip_jesd204_tpl_adc_0/s_axi] [get_bd_intf_pins s_axi2]
connect_bd_intf_net [get_bd_intf_pins axi_adxcvr_0/m_axi] [get_bd_intf_pins SVV_AXI_VOID_0/S_AXI]
connect_bd_intf_net [get_bd_intf_pins axi_adxcvr_0/up_ch_0] [get_bd_intf_pins util_adxcvr_0/up_rx_0]
connect_bd_intf_net [get_bd_intf_pins axi_adxcvr_0/up_ch_1] [get_bd_intf_pins util_adxcvr_0/up_rx_1]
connect_bd_intf_net [get_bd_intf_pins axi_adxcvr_0/up_ch_2] [get_bd_intf_pins util_adxcvr_0/up_rx_2]
connect_bd_intf_net [get_bd_intf_pins axi_adxcvr_0/up_ch_3] [get_bd_intf_pins util_adxcvr_0/up_rx_3]
connect_bd_intf_net [get_bd_intf_pins axi_adxcvr_0/up_cm_0] [get_bd_intf_pins util_adxcvr_0/up_cm_0]
connect_bd_intf_net [get_bd_intf_pins axi_adxcvr_0/up_es_0] [get_bd_intf_pins util_adxcvr_0/up_es_0]
connect_bd_intf_net [get_bd_intf_pins axi_adxcvr_0/up_es_1] [get_bd_intf_pins util_adxcvr_0/up_es_1]
connect_bd_intf_net [get_bd_intf_pins axi_adxcvr_0/up_es_2] [get_bd_intf_pins util_adxcvr_0/up_es_2]
connect_bd_intf_net [get_bd_intf_pins axi_adxcvr_0/up_es_3] [get_bd_intf_pins util_adxcvr_0/up_es_3]
connect_bd_intf_net [get_bd_intf_pins axi_jesd204_rx_0/rx_cfg] [get_bd_intf_pins jesd204_rx_0/rx_cfg]
connect_bd_intf_net [get_bd_intf_pins axi_jesd204_rx_0/rx_event] [get_bd_intf_pins jesd204_rx_0/rx_event]
connect_bd_intf_net [get_bd_intf_pins axi_jesd204_rx_0/rx_ilas_config] [get_bd_intf_pins jesd204_rx_0/rx_ilas_config]
connect_bd_intf_net [get_bd_intf_pins axi_jesd204_rx_0/rx_status] [get_bd_intf_pins jesd204_rx_0/rx_status]
connect_bd_intf_net [get_bd_intf_pins s_axi] [get_bd_intf_pins axi_adxcvr_0/s_axi]
connect_bd_intf_net [get_bd_intf_pins util_adxcvr_0/rx_0] [get_bd_intf_pins jesd204_rx_0/rx_phy0]
connect_bd_intf_net [get_bd_intf_pins util_adxcvr_0/rx_1] [get_bd_intf_pins jesd204_rx_0/rx_phy1]
connect_bd_intf_net [get_bd_intf_pins util_adxcvr_0/rx_2] [get_bd_intf_pins jesd204_rx_0/rx_phy2]
connect_bd_intf_net [get_bd_intf_pins util_adxcvr_0/rx_3] [get_bd_intf_pins jesd204_rx_0/rx_phy3]
connect_bd_net [get_bd_pins CLK0_JESD_N] [get_bd_pins SER7_IBUFDS_GTE2_v1_0_0/IB]
connect_bd_net [get_bd_pins CLK0_JESD_P] [get_bd_pins SER7_IBUFDS_GTE2_v1_0_0/I]
connect_bd_net [get_bd_pins SER7_IBUFDS_GTE2_v1_0_0/O] \
  [get_bd_pins util_adxcvr_0/qpll_ref_clk_0] [get_bd_pins util_adxcvr_0/cpll_ref_clk_0] \
  [get_bd_pins util_adxcvr_0/cpll_ref_clk_1] [get_bd_pins util_adxcvr_0/cpll_ref_clk_2] \
  [get_bd_pins util_adxcvr_0/cpll_ref_clk_3]
connect_bd_net [get_bd_pins ad_ip_jesd204_tpl_adc_0/adc_data] [get_bd_pins xlslice_0/Din] [get_bd_pins xlslice_1/Din]
connect_bd_net [get_bd_pins ad_sysref_gen_0/sysref_out] [get_bd_pins jesd204_rx_0/sysref]
connect_bd_net [get_bd_pins axi_adxcvr_0/up_pll_rst] \
  [get_bd_pins util_adxcvr_0/up_qpll_rst_0] [get_bd_pins util_adxcvr_0/up_cpll_rst_0] \
  [get_bd_pins util_adxcvr_0/up_cpll_rst_1] [get_bd_pins util_adxcvr_0/up_cpll_rst_2] \
  [get_bd_pins util_adxcvr_0/up_cpll_rst_3]
connect_bd_net [get_bd_pins axi_jesd204_rx_0/core_reset] [get_bd_pins jesd204_rx_0/reset]
connect_bd_net [get_bd_pins axi_jesd204_rx_0/device_reset] [get_bd_pins jesd204_rx_0/device_reset]
connect_bd_net -net clk_wiz_0_clk_out_100M [get_bd_pins s_axi_aclk] \
  [get_bd_pins axi_adxcvr_0/s_axi_aclk] [get_bd_pins axi_jesd204_rx_0/s_axi_aclk] [get_bd_pins util_adxcvr_0/up_clk] \
  [get_bd_pins ad_ip_jesd204_tpl_adc_0/s_axi_aclk] [get_bd_pins SVV_AXI_VOID_0/s_axi_aclk]
connect_bd_net [get_bd_pins jesd204_rx_0/phy_en_char_align] \
  [get_bd_pins util_adxcvr_0/rx_calign_3] [get_bd_pins util_adxcvr_0/rx_calign_2] [get_bd_pins util_adxcvr_0/rx_calign_1] \
  [get_bd_pins util_adxcvr_0/rx_calign_0]
connect_bd_net [get_bd_pins jesd204_rx_0/rx_data] [get_bd_pins ad_ip_jesd204_tpl_adc_0/link_data]
connect_bd_net [get_bd_pins jesd204_rx_0/rx_sof] [get_bd_pins ad_ip_jesd204_tpl_adc_0/link_sof]
connect_bd_net [get_bd_pins jesd204_rx_0/rx_valid] [get_bd_pins ad_ip_jesd204_tpl_adc_0/link_valid]
connect_bd_net [get_bd_pins jesd204_rx_0/sync] [get_bd_pins rx_sync_1]
connect_bd_net -net rst_clk_wiz_0_200M_peripheral_aresetn [get_bd_pins s_axi_aresetn] \
  [get_bd_pins axi_adxcvr_0/s_axi_aresetn] [get_bd_pins axi_jesd204_rx_0/s_axi_aresetn] [get_bd_pins util_adxcvr_0/up_rstn] \
  [get_bd_pins SVV_AXI_VOID_0/s_axi_aresetn]
connect_bd_net [get_bd_pins rx_1_0_n] [get_bd_pins util_adxcvr_0/rx_0_n]
connect_bd_net [get_bd_pins rx_1_0_p] [get_bd_pins util_adxcvr_0/rx_0_p]
connect_bd_net [get_bd_pins rx_1_1_n] [get_bd_pins util_adxcvr_0/rx_1_n]
connect_bd_net [get_bd_pins rx_1_1_p] [get_bd_pins util_adxcvr_0/rx_1_p]
connect_bd_net [get_bd_pins rx_1_2_n] [get_bd_pins util_adxcvr_0/rx_2_n]
connect_bd_net [get_bd_pins rx_1_2_p] [get_bd_pins util_adxcvr_0/rx_2_p]
connect_bd_net [get_bd_pins rx_1_3_n] [get_bd_pins util_adxcvr_0/rx_3_n]
connect_bd_net [get_bd_pins rx_1_3_p] [get_bd_pins util_adxcvr_0/rx_3_p]
connect_bd_net -net s_axi_aresetn1_1 [get_bd_pins s_axi_aresetn1] [get_bd_pins ad_ip_jesd204_tpl_adc_0/s_axi_aresetn]
connect_bd_net [get_bd_pins util_adxcvr_0/rx_out_clk_0] \
  [get_bd_pins util_adxcvr_0/rx_clk_0] [get_bd_pins util_adxcvr_0/rx_clk_1] [get_bd_pins util_adxcvr_0/rx_clk_2] \
  [get_bd_pins util_adxcvr_0/rx_clk_3] [get_bd_pins axi_jesd204_rx_0/core_clk] [get_bd_pins jesd204_rx_0/clk] \
  [get_bd_pins ad_sysref_gen_0/core_clk] [get_bd_pins jesd204_rx_0/device_clk] [get_bd_pins axi_jesd204_rx_0/device_clk] \
  [get_bd_pins ad_ip_jesd204_tpl_adc_0/link_clk]
connect_bd_net [get_bd_pins xlconstant_0/dout] [get_bd_pins ad_sysref_gen_0/sysref_en]
connect_bd_net [get_bd_pins xlconstant_1/dout] [get_bd_pins ad_ip_jesd204_tpl_adc_0/adc_dovf]
connect_bd_net [get_bd_pins xlslice_0/Dout] [get_bd_pins ADC_DATA_0]
connect_bd_net [get_bd_pins xlslice_1/Dout] [get_bd_pins ADC_DATA_1]

current_bd_instance /JESD204B_RX_CHAIN_2
connect_bd_intf_net [get_bd_intf_pins axi_adxcvr_1/s_axi] [get_bd_intf_pins s_axi]
connect_bd_intf_net [get_bd_intf_pins axi_jesd204_rx_1/s_axi] [get_bd_intf_pins s_axi1]
connect_bd_intf_net [get_bd_intf_pins ad_ip_jesd204_tpl_adc_1/s_axi] [get_bd_intf_pins s_axi2]
connect_bd_intf_net -intf_net axi_adxcvr_0_m_axi [get_bd_intf_pins SVV_AXI_VOID_1/S_AXI] [get_bd_intf_pins axi_adxcvr_1/m_axi]
connect_bd_intf_net -intf_net axi_adxcvr_0_up_ch_0 [get_bd_intf_pins axi_adxcvr_1/up_ch_0] [get_bd_intf_pins util_adxcvr_1/up_rx_0]
connect_bd_intf_net -intf_net axi_adxcvr_0_up_ch_1 [get_bd_intf_pins axi_adxcvr_1/up_ch_1] [get_bd_intf_pins util_adxcvr_1/up_rx_1]
connect_bd_intf_net -intf_net axi_adxcvr_0_up_ch_2 [get_bd_intf_pins axi_adxcvr_1/up_ch_2] [get_bd_intf_pins util_adxcvr_1/up_rx_2]
connect_bd_intf_net -intf_net axi_adxcvr_0_up_ch_3 [get_bd_intf_pins axi_adxcvr_1/up_ch_3] [get_bd_intf_pins util_adxcvr_1/up_rx_3]
connect_bd_intf_net -intf_net axi_adxcvr_0_up_cm_0 [get_bd_intf_pins axi_adxcvr_1/up_cm_0] [get_bd_intf_pins util_adxcvr_1/up_cm_0]
connect_bd_intf_net -intf_net axi_adxcvr_0_up_es_0 [get_bd_intf_pins axi_adxcvr_1/up_es_0] [get_bd_intf_pins util_adxcvr_1/up_es_0]
connect_bd_intf_net -intf_net axi_adxcvr_0_up_es_1 [get_bd_intf_pins axi_adxcvr_1/up_es_1] [get_bd_intf_pins util_adxcvr_1/up_es_1]
connect_bd_intf_net -intf_net axi_adxcvr_0_up_es_2 [get_bd_intf_pins axi_adxcvr_1/up_es_2] [get_bd_intf_pins util_adxcvr_1/up_es_2]
connect_bd_intf_net -intf_net axi_adxcvr_0_up_es_3 [get_bd_intf_pins axi_adxcvr_1/up_es_3] [get_bd_intf_pins util_adxcvr_1/up_es_3]
connect_bd_intf_net -intf_net axi_jesd204_rx_0_rx_cfg [get_bd_intf_pins axi_jesd204_rx_1/rx_cfg] [get_bd_intf_pins jesd204_rx_1/rx_cfg]
connect_bd_intf_net -intf_net jesd204_rx_0_rx_event [get_bd_intf_pins jesd204_rx_1/rx_event] [get_bd_intf_pins axi_jesd204_rx_1/rx_event]
connect_bd_intf_net -intf_net jesd204_rx_0_rx_ilas_config [get_bd_intf_pins jesd204_rx_1/rx_ilas_config] [get_bd_intf_pins axi_jesd204_rx_1/rx_ilas_config]
connect_bd_intf_net -intf_net jesd204_rx_0_rx_status [get_bd_intf_pins jesd204_rx_1/rx_status] [get_bd_intf_pins axi_jesd204_rx_1/rx_status]
connect_bd_intf_net -intf_net util_adxcvr_0_rx_0 [get_bd_intf_pins util_adxcvr_1/rx_0] [get_bd_intf_pins jesd204_rx_1/rx_phy0]
connect_bd_intf_net -intf_net util_adxcvr_0_rx_1 [get_bd_intf_pins util_adxcvr_1/rx_1] [get_bd_intf_pins jesd204_rx_1/rx_phy1]
connect_bd_intf_net -intf_net util_adxcvr_0_rx_2 [get_bd_intf_pins util_adxcvr_1/rx_2] [get_bd_intf_pins jesd204_rx_1/rx_phy2]
connect_bd_intf_net -intf_net util_adxcvr_0_rx_3 [get_bd_intf_pins jesd204_rx_1/rx_phy3] [get_bd_intf_pins util_adxcvr_1/rx_3]
connect_bd_net [get_bd_pins CLK1_JESD_N] [get_bd_pins SER7_IBUFDS_GTE2_v1_0_1/IB]
connect_bd_net [get_bd_pins CLK1_JESD_P] [get_bd_pins SER7_IBUFDS_GTE2_v1_0_1/I]
connect_bd_net [get_bd_pins SER7_IBUFDS_GTE2_v1_0_1/O] \
  [get_bd_pins util_adxcvr_1/qpll_ref_clk_0] [get_bd_pins util_adxcvr_1/cpll_ref_clk_0] \
  [get_bd_pins util_adxcvr_1/cpll_ref_clk_1] [get_bd_pins util_adxcvr_1/cpll_ref_clk_2] \
  [get_bd_pins util_adxcvr_1/cpll_ref_clk_3]
connect_bd_net -net ad_ip_jesd204_tpl_adc_0_adc_data [get_bd_pins ad_ip_jesd204_tpl_adc_1/adc_data] \
  [get_bd_pins xlslice_0/Din] [get_bd_pins xlslice_1/Din]
connect_bd_net [get_bd_pins ad_sysref_gen_0/sysref_out] [get_bd_pins jesd204_rx_1/sysref]
connect_bd_net -net axi_adxcvr_0_up_pll_rst [get_bd_pins axi_adxcvr_1/up_pll_rst] \
  [get_bd_pins util_adxcvr_1/up_qpll_rst_0] [get_bd_pins util_adxcvr_1/up_cpll_rst_0] \
  [get_bd_pins util_adxcvr_1/up_cpll_rst_1] [get_bd_pins util_adxcvr_1/up_cpll_rst_2] \
  [get_bd_pins util_adxcvr_1/up_cpll_rst_3]
connect_bd_net -net axi_jesd204_rx_0_core_reset [get_bd_pins axi_jesd204_rx_1/core_reset] [get_bd_pins jesd204_rx_1/reset]
connect_bd_net -net axi_jesd204_rx_0_device_reset [get_bd_pins axi_jesd204_rx_1/device_reset] [get_bd_pins jesd204_rx_1/device_reset]
connect_bd_net -net jesd204_rx_0_phy_en_char_align [get_bd_pins jesd204_rx_1/phy_en_char_align] \
  [get_bd_pins util_adxcvr_1/rx_calign_3] [get_bd_pins util_adxcvr_1/rx_calign_2] [get_bd_pins util_adxcvr_1/rx_calign_1] \
  [get_bd_pins util_adxcvr_1/rx_calign_0]
connect_bd_net -net jesd204_rx_0_rx_data [get_bd_pins jesd204_rx_1/rx_data] [get_bd_pins ad_ip_jesd204_tpl_adc_1/link_data]
connect_bd_net -net jesd204_rx_0_rx_sof [get_bd_pins jesd204_rx_1/rx_sof] [get_bd_pins ad_ip_jesd204_tpl_adc_1/link_sof]
connect_bd_net -net jesd204_rx_0_rx_valid [get_bd_pins jesd204_rx_1/rx_valid] [get_bd_pins ad_ip_jesd204_tpl_adc_1/link_valid]
connect_bd_net -net jesd204_rx_0_sync [get_bd_pins jesd204_rx_1/sync] [get_bd_pins rx_sync_2]
connect_bd_net [get_bd_pins rx_2_0_n] [get_bd_pins util_adxcvr_1/rx_0_n]
connect_bd_net [get_bd_pins rx_2_0_p] [get_bd_pins util_adxcvr_1/rx_0_p]
connect_bd_net [get_bd_pins rx_2_1_n] [get_bd_pins util_adxcvr_1/rx_1_n]
connect_bd_net [get_bd_pins rx_2_1_p] [get_bd_pins util_adxcvr_1/rx_1_p]
connect_bd_net [get_bd_pins rx_2_2_n] [get_bd_pins util_adxcvr_1/rx_2_n]
connect_bd_net [get_bd_pins rx_2_2_p] [get_bd_pins util_adxcvr_1/rx_2_p]
connect_bd_net [get_bd_pins rx_2_3_n] [get_bd_pins util_adxcvr_1/rx_3_n]
connect_bd_net [get_bd_pins rx_2_3_p] [get_bd_pins util_adxcvr_1/rx_3_p]
connect_bd_net [get_bd_pins s_axi_aclk] \
  [get_bd_pins axi_adxcvr_1/s_axi_aclk] [get_bd_pins util_adxcvr_1/up_clk] [get_bd_pins axi_jesd204_rx_1/s_axi_aclk] \
  [get_bd_pins ad_ip_jesd204_tpl_adc_1/s_axi_aclk] [get_bd_pins SVV_AXI_VOID_1/s_axi_aclk]
connect_bd_net -net s_axi_aresetn1_1 [get_bd_pins s_axi_aresetn1] [get_bd_pins ad_ip_jesd204_tpl_adc_1/s_axi_aresetn]
connect_bd_net [get_bd_pins s_axi_aresetn] \
  [get_bd_pins axi_adxcvr_1/s_axi_aresetn] [get_bd_pins util_adxcvr_1/up_rstn] [get_bd_pins axi_jesd204_rx_1/s_axi_aresetn] \
  [get_bd_pins SVV_AXI_VOID_1/s_axi_aresetn]
connect_bd_net -net util_adxcvr_0_rx_out_clk_0 [get_bd_pins util_adxcvr_1/rx_out_clk_0] \
  [get_bd_pins ad_sysref_gen_0/core_clk] [get_bd_pins ad_ip_jesd204_tpl_adc_1/link_clk] [get_bd_pins jesd204_rx_1/clk] \
  [get_bd_pins jesd204_rx_1/device_clk] [get_bd_pins util_adxcvr_1/rx_clk_3] [get_bd_pins util_adxcvr_1/rx_clk_2] \
  [get_bd_pins util_adxcvr_1/rx_clk_1] [get_bd_pins util_adxcvr_1/rx_clk_0] [get_bd_pins axi_jesd204_rx_1/core_clk] \
  [get_bd_pins axi_jesd204_rx_1/device_clk]
connect_bd_net [get_bd_pins xlconstant_0/dout] [get_bd_pins ad_sysref_gen_0/sysref_en]
connect_bd_net [get_bd_pins xlconstant_1/dout] [get_bd_pins ad_ip_jesd204_tpl_adc_1/adc_dovf]
connect_bd_net [get_bd_pins xlslice_0/Dout] [get_bd_pins ADC_DATA_2]
connect_bd_net [get_bd_pins xlslice_1/Dout] [get_bd_pins ADC_DATA_3]

current_bd_instance /
connect_bd_intf_net [get_bd_intf_ports DDS_AD9915] [get_bd_intf_pins DDS_CTRL_0/AD9915]
connect_bd_intf_net -intf_net SERIAL_BUF_CONFIG_0_SER_TRANS [get_bd_intf_ports STR4_PN] [get_bd_intf_pins UARTS_AND_STROBES/STR4_PN]
connect_bd_intf_net -intf_net SERIAL_BUF_CONFIG_1_SER_TRANS [get_bd_intf_ports STR1_PN] [get_bd_intf_pins UARTS_AND_STROBES/STR1_PN]
connect_bd_intf_net -intf_net SERIAL_BUF_CONFIG_2_SER_TRANS [get_bd_intf_ports STR2_PRD] [get_bd_intf_pins UARTS_AND_STROBES/STR2_PRD]
connect_bd_intf_net -intf_net SERIAL_BUF_CONFIG_3_SER_TRANS [get_bd_intf_ports STR3_PRM] [get_bd_intf_pins UARTS_AND_STROBES/STR3_PRM]
connect_bd_intf_net -intf_net SERIAL_BUF_CONFIG_4_SER_TRANS [get_bd_intf_ports RS485_2_PC] [get_bd_intf_pins UARTS_AND_STROBES/RS485_2_PC]
connect_bd_intf_net -intf_net SERIAL_BUF_CONFIG_5_SER_TRANS [get_bd_intf_ports RS485_1_AFAR] [get_bd_intf_pins UARTS_AND_STROBES/RS485_1_AFAR]
connect_bd_intf_net [get_bd_intf_ports RS485_3] [get_bd_intf_pins UARTS_AND_STROBES/RS485_3]
connect_bd_intf_net [get_bd_intf_ports RS485_4] [get_bd_intf_pins UARTS_AND_STROBES/RS485_4]
connect_bd_intf_net [get_bd_intf_ports STR5] [get_bd_intf_pins UARTS_AND_STROBES/STR5]
connect_bd_intf_net [get_bd_intf_ports STR6] [get_bd_intf_pins UARTS_AND_STROBES/STR6]
connect_bd_intf_net [get_bd_intf_ports STR7] [get_bd_intf_pins UARTS_AND_STROBES/STR7]
connect_bd_intf_net [get_bd_intf_ports STR8] [get_bd_intf_pins UARTS_AND_STROBES/STR8]
connect_bd_intf_net -intf_net microblaze_0_axi_dp [get_bd_intf_pins microblaze_0_axi_periph/S00_AXI] [get_bd_intf_pins microblaze_0/M_AXI_DP]
connect_bd_intf_net [get_bd_intf_pins microblaze_0_axi_periph/M01_AXI] [get_bd_intf_pins mdm_0/S_AXI]
connect_bd_intf_net [get_bd_intf_pins microblaze_0_axi_periph/M02_AXI] [get_bd_intf_pins BCO_PROFILE_0/s00_axi]
connect_bd_intf_net [get_bd_intf_pins microblaze_0_axi_periph/M03_AXI] [get_bd_intf_pins DDS_CTRL_0/s00_axi]
connect_bd_intf_net [get_bd_intf_pins microblaze_0_axi_periph/M04_AXI] [get_bd_intf_pins PROFILES_AND_STROBES/S_AXI]
connect_bd_intf_net [get_bd_intf_pins microblaze_0_axi_periph/M05_AXI] [get_bd_intf_pins UARTS_AND_STROBES/S_AXI1]
connect_bd_intf_net [get_bd_intf_pins microblaze_0_axi_periph/M06_AXI] [get_bd_intf_pins UARTS_AND_STROBES/S_AXI]
connect_bd_intf_net [get_bd_intf_pins microblaze_0_axi_periph/M07_AXI] [get_bd_intf_pins SVV_AXI_CYCCNT_0/S_AXI]
connect_bd_intf_net [get_bd_intf_pins microblaze_0_axi_periph/M08_AXI] [get_bd_intf_pins UARTS_AND_STROBES/S_AXI3]
connect_bd_intf_net [get_bd_intf_pins microblaze_0_axi_periph/M09_AXI] [get_bd_intf_pins JESD204B_RX_CHAIN_1/s_axi]
connect_bd_intf_net [get_bd_intf_pins microblaze_0_axi_periph/M10_AXI] [get_bd_intf_pins SVV_AXI_GPIO_0/S00_AXI]
connect_bd_intf_net [get_bd_intf_pins microblaze_0_axi_periph/M11_AXI] [get_bd_intf_pins SVV_AXI_ADI_SPI_LMK/S_AXI]
connect_bd_intf_net [get_bd_intf_pins microblaze_0_axi_periph/M12_AXI] [get_bd_intf_pins SVV_AXI_ADI_SPI_ADC/S_AXI]
connect_bd_intf_net [get_bd_intf_pins microblaze_0_axi_periph/M13_AXI] [get_bd_intf_pins JESD204B_RX_CHAIN_1/s_axi1]
connect_bd_intf_net [get_bd_intf_pins microblaze_0_axi_periph/M14_AXI] [get_bd_intf_pins JESD204B_RX_CHAIN_1/s_axi2]
connect_bd_intf_net [get_bd_intf_pins microblaze_0_axi_periph/M15_AXI] [get_bd_intf_pins JESD204B_RX_CHAIN_2/s_axi]
connect_bd_intf_net [get_bd_intf_pins microblaze_0_axi_periph/M16_AXI] [get_bd_intf_pins JESD204B_RX_CHAIN_2/s_axi1]
connect_bd_intf_net [get_bd_intf_pins microblaze_0_axi_periph/M17_AXI] [get_bd_intf_pins JESD204B_RX_CHAIN_2/s_axi2]
connect_bd_intf_net [get_bd_intf_pins mdm_0/MBDEBUG_0] [get_bd_intf_pins microblaze_0/DEBUG]
connect_bd_intf_net [get_bd_intf_pins microblaze_0/DLMB] [get_bd_intf_pins microblaze_0_local_memory/DLMB]
connect_bd_intf_net [get_bd_intf_pins microblaze_0/ILMB] [get_bd_intf_pins microblaze_0_local_memory/ILMB]
connect_bd_intf_net -intf_net microblaze_0_intc_axi [get_bd_intf_pins microblaze_0_axi_periph/M00_AXI] [get_bd_intf_pins microblaze_0_axi_intc/s_axi]
connect_bd_intf_net [get_bd_intf_pins microblaze_0_axi_intc/interrupt] [get_bd_intf_pins microblaze_0/INTERRUPT]
connect_bd_net [get_bd_pins BCO_PROFILE_0/clk_adc_div_16] [get_bd_pins DDS_CTRL_0/clk_dds]
connect_bd_net [get_bd_pins BCO_PROFILE_0/cur_prof] [get_bd_pins DDS_CTRL_0/CUR_PROF]
connect_bd_net [get_bd_pins BCO_PROFILE_0/nxt_prof] [get_bd_pins DDS_CTRL_0/NXT_PROF]
connect_bd_net [get_bd_pins BCO_PROFILE_0/str_dds] [get_bd_pins DDS_CTRL_0/str_prd]
connect_bd_net [get_bd_pins BCO_PROFILE_0/str_pn] [get_bd_pins DDS_CTRL_0/str_pn]
connect_bd_net [get_bd_pins BCO_PROFILE_0/str_pn_out] [get_bd_pins UARTS_AND_STROBES/STR_PN]
connect_bd_net [get_bd_pins BCO_PROFILE_0/str_prd] [get_bd_pins UARTS_AND_STROBES/STR_PRD]
connect_bd_net [get_bd_pins BCO_PROFILE_0/str_prm] [get_bd_pins UARTS_AND_STROBES/STR_PRM]
connect_bd_net [get_bd_ports CLK0_JESD_N] [get_bd_pins JESD204B_RX_CHAIN_1/CLK0_JESD_N]
connect_bd_net [get_bd_ports CLK0_JESD_P] [get_bd_pins JESD204B_RX_CHAIN_1/CLK0_JESD_P]
connect_bd_net [get_bd_ports CLK1_JESD_N] [get_bd_pins JESD204B_RX_CHAIN_2/CLK1_JESD_N]
connect_bd_net [get_bd_ports CLK1_JESD_P] [get_bd_pins JESD204B_RX_CHAIN_2/CLK1_JESD_P]
connect_bd_net [get_bd_pins JESD204B_RX_CHAIN_1/rx_sync_1] [get_bd_ports rx_sync_1]
connect_bd_net -net JESD204B_RX_CHAIN_2_sync_0 [get_bd_pins JESD204B_RX_CHAIN_2/rx_sync_2] [get_bd_ports rx_sync_2]
connect_bd_net [get_bd_ports LMK04828_sdio] [get_bd_pins SVV_AXI_ADI_SPI_LMK/SDIO]
connect_bd_net [get_bd_ports ADC_sdio] [get_bd_pins SVV_AXI_ADI_SPI_ADC/SDIO]
connect_bd_net [get_bd_pins PROFILES_AND_STROBES/en_zond] [get_bd_ports P74]
connect_bd_net [get_bd_pins PROFILES_AND_STROBES/str_pn] [get_bd_ports P76]
connect_bd_net [get_bd_pins PROFILES_AND_STROBES/str_prd] [get_bd_ports P77]
connect_bd_net [get_bd_pins PROFILES_AND_STROBES/str_prm] [get_bd_ports P78]
connect_bd_net -net SIN_USB1_1 [get_bd_ports SIN_USB1] [get_bd_pins UARTS_AND_STROBES/sin_usb1]
connect_bd_net -net SVV_AXI_ADI_SPI_0_SCLK [get_bd_pins SVV_AXI_ADI_SPI_ADC/SCLK] [get_bd_ports ADC_sclk]
connect_bd_net -net SVV_AXI_ADI_SPI_0_nCS [get_bd_pins SVV_AXI_ADI_SPI_ADC/nCS] [get_bd_ports ADC_nCS]
connect_bd_net [get_bd_pins SVV_AXI_ADI_SPI_LMK/SCLK] [get_bd_ports LMK04828_sclk]
connect_bd_net [get_bd_pins SVV_AXI_ADI_SPI_LMK/nCS] [get_bd_ports LMK04828_ncs]
connect_bd_net [get_bd_pins SVV_AXI_GPIO_0/DIR] [get_bd_pins SVV_AXI_GPIO_0/GPI]
connect_bd_net [get_bd_pins SVV_AXI_GPIO_0/GPO] [get_bd_pins xlslice_1/Din] [get_bd_pins xlslice_0/Din] [get_bd_pins xlslice_2/Din]
connect_bd_net [get_bd_pins UARTS_AND_STROBES/RESET_USB1] [get_bd_ports RESET_USB1]
connect_bd_net [get_bd_pins UARTS_AND_STROBES/intr_uart_rs485_afar] [get_bd_pins microblaze_0_xlconcat/In3]
connect_bd_net [get_bd_pins UARTS_AND_STROBES/intr_uart_rs485_pc] [get_bd_pins microblaze_0_xlconcat/In8]
connect_bd_net [get_bd_pins UARTS_AND_STROBES/intr_uart_usb1] [get_bd_pins microblaze_0_xlconcat/In2]
connect_bd_net [get_bd_pins UARTS_AND_STROBES/sout_usb1] [get_bd_ports SOUT_USB1]
connect_bd_net -net clk_in1_1 [get_bd_ports clk_in1] [get_bd_pins clk_wiz_0/clk_in1]
connect_bd_net [get_bd_pins clk_wiz_0/clk_out_100M] \
  [get_bd_pins microblaze_0/Clk] [get_bd_pins microblaze_0_local_memory/clk_in1] \
  [get_bd_pins microblaze_0_axi_intc/s_axi_aclk] [get_bd_pins rst_wiz_100M/slowest_sync_clk] [get_bd_pins mdm_0/S_AXI_ACLK] \
  [get_bd_pins microblaze_0_axi_intc/processor_clk] [get_bd_pins BCO_PROFILE_0/s00_axi_aclk] \
  [get_bd_pins DDS_CTRL_0/s00_axi_aclk] [get_bd_pins microblaze_0_axi_periph/ACLK] \
  [get_bd_pins microblaze_0_axi_periph/S00_ACLK] [get_bd_pins microblaze_0_axi_periph/M00_ACLK] \
  [get_bd_pins microblaze_0_axi_periph/M01_ACLK] [get_bd_pins microblaze_0_axi_periph/M02_ACLK] \
  [get_bd_pins microblaze_0_axi_periph/M03_ACLK] [get_bd_pins microblaze_0_axi_periph/M04_ACLK] \
  [get_bd_pins microblaze_0_axi_periph/M05_ACLK] [get_bd_pins microblaze_0_axi_periph/M06_ACLK] \
  [get_bd_pins UARTS_AND_STROBES/s_axi_aclk] [get_bd_pins microblaze_0_axi_periph/M07_ACLK] \
  [get_bd_pins microblaze_0_axi_periph/M08_ACLK] [get_bd_pins SVV_AXI_CYCCNT_0/s_axi_aclk] \
  [get_bd_pins PROFILES_AND_STROBES/s_axi_aclk] [get_bd_pins fit_timer_0/Clk] [get_bd_pins microblaze_0_axi_periph/M09_ACLK] \
  [get_bd_pins JESD204B_RX_CHAIN_1/s_axi_aclk] [get_bd_pins microblaze_0_axi_periph/M10_ACLK] \
  [get_bd_pins SVV_AXI_GPIO_0/s00_axi_aclk] [get_bd_pins microblaze_0_axi_periph/M11_ACLK] \
  [get_bd_pins microblaze_0_axi_periph/M12_ACLK] [get_bd_pins microblaze_0_axi_periph/M13_ACLK] \
  [get_bd_pins microblaze_0_axi_periph/M14_ACLK] [get_bd_pins JESD204B_RX_CHAIN_2/s_axi_aclk] \
  [get_bd_pins microblaze_0_axi_periph/M15_ACLK] [get_bd_pins microblaze_0_axi_periph/M16_ACLK] \
  [get_bd_pins microblaze_0_axi_periph/M17_ACLK] [get_bd_pins SVV_AXI_ADI_SPI_LMK/s_axi_aclk] \
  [get_bd_pins SVV_AXI_ADI_SPI_ADC/s_axi_aclk]
connect_bd_net [get_bd_pins clk_wiz_0/clk_out_125M] [get_bd_pins BCO_PROFILE_0/clk_prof] [get_bd_pins PROFILES_AND_STROBES/clk_prof]
connect_bd_net [get_bd_pins clk_wiz_0/locked] [get_bd_pins rst_wiz_100M/dcm_locked]
connect_bd_net [get_bd_pins fit_timer_0/Interrupt] [get_bd_pins microblaze_0_xlconcat/In14]
connect_bd_net [get_bd_pins mdm_0/Interrupt] [get_bd_pins microblaze_0_xlconcat/In12]
connect_bd_net -net mdm_1_debug_sys_rst [get_bd_pins mdm_0/Debug_SYS_Rst] [get_bd_pins rst_wiz_100M/mb_debug_sys_rst]
connect_bd_net [get_bd_pins microblaze_0_xlconcat/dout] [get_bd_pins microblaze_0_axi_intc/intr]
connect_bd_net -net rst_clk_in1_100M_bus_struct_reset [get_bd_pins rst_wiz_100M/bus_struct_reset] [get_bd_pins microblaze_0_local_memory/SYS_Rst]
connect_bd_net -net rst_clk_in1_100M_mb_reset [get_bd_pins rst_wiz_100M/mb_reset] \
  [get_bd_pins microblaze_0/Reset] [get_bd_pins microblaze_0_axi_intc/processor_rst]
